# EAGLE design RelayBoard (EAGLE 5.12)

## Sheet 1 of 4
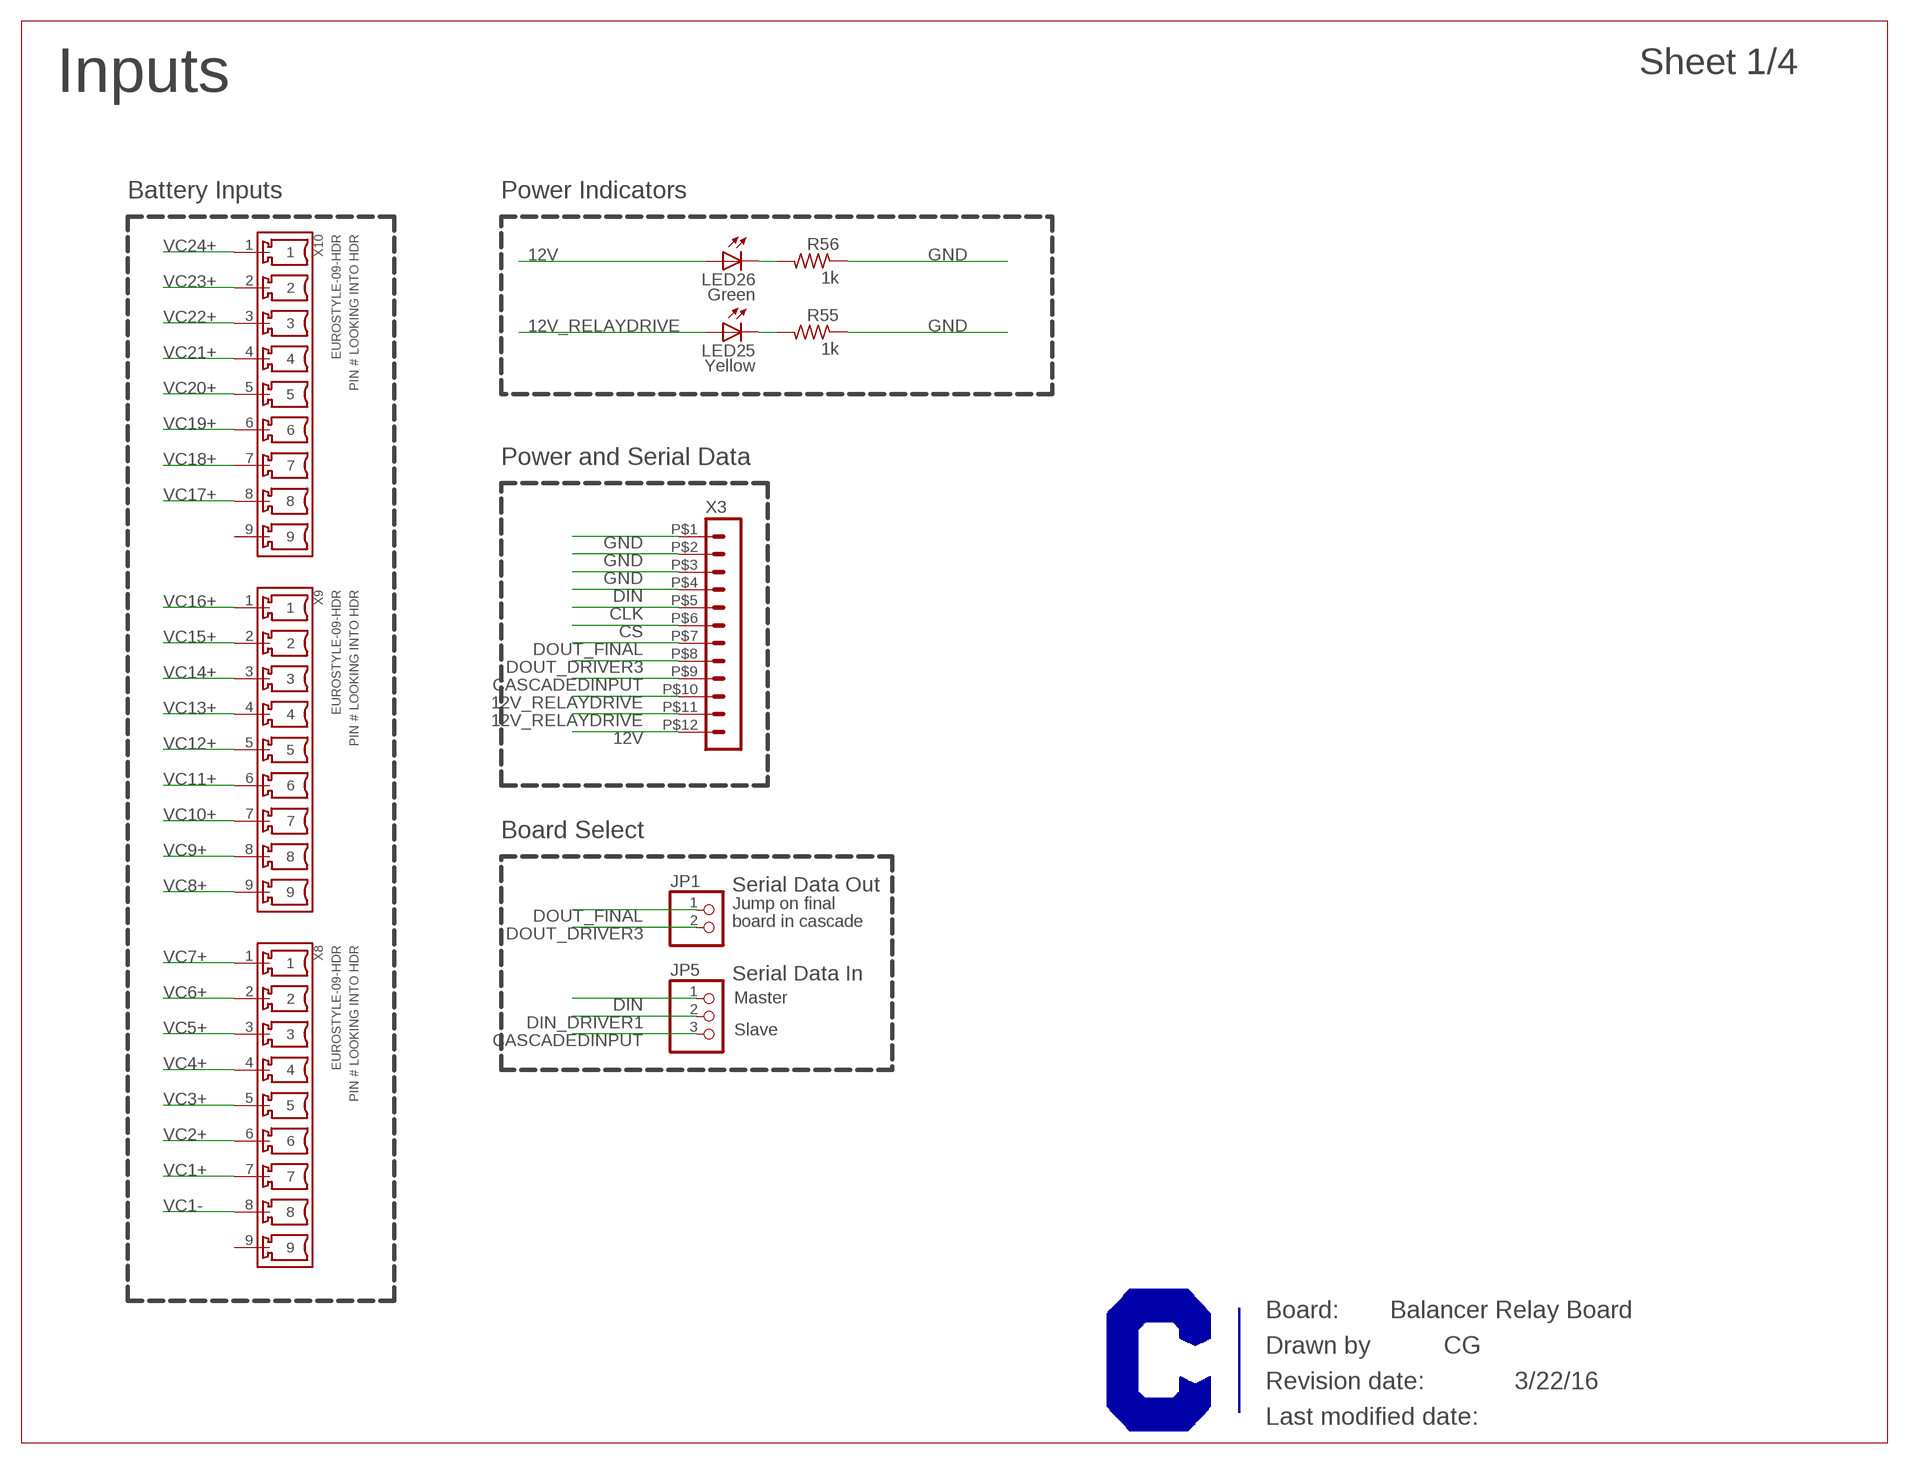
[diagram p0: schematic, sheet 1]

### Parts
JP1  PINHD-1X2  [1X02]
JP5  PINHD-1X3  [1X03]
LED25  Yellow  LEDSML0805  [SML0805]
LED26  Green  LEDSML0805  [SML0805]
R55  1k  R-US_R0603  [R0603]
R56  1k  R-US_R0603  [R0603]
X3  HEADER_POS12_43045-1200  [43045-1200]
X8  EUROSTYLE-09-HDR  [EUROSTYLE_HEADER-9CKT-RA]
X9  EUROSTYLE-09-HDR  [EUROSTYLE_HEADER-9CKT-RA]
X10  EUROSTYLE-09-HDR  [EUROSTYLE_HEADER-9CKT-RA]

### Nets
12V: LED26.A X3.P$12 ; also sheet 2,3,4
12V_RELAYDRIVE [100ma]: LED25.A X3.P$10 X3.P$11 ; also sheet 2,3,4
CASCADEDINPUT: JP5.3 X3.P$9
CLK: X3.P$5 ; also sheet 2,3,4
CS: X3.P$6 ; also sheet 2,3,4
DIN: JP5.1 X3.P$4
DIN_DRIVER1: JP5.2 ; also sheet 2
DOUT_DRIVER3: JP1.2 X3.P$8 ; also sheet 4
DOUT_FINAL: JP1.1 X3.P$7
GND: R55.1 R56.1 X3.P$1 X3.P$2 X3.P$3 ; also sheet 2,3,4
N$49: LED25.C R55.2
N$50: LED26.C R56.2
VC1+ [5A]: X8.7 ; also sheet 4
VC1- [5A]: X8.8 ; also sheet 4
VC2+ [5A]: X8.6 ; also sheet 4
VC3+ [5A]: X8.5 ; also sheet 4
VC4+ [5A]: X8.4 ; also sheet 4
VC5+ [5A]: X8.3 ; also sheet 4
VC6+ [5A]: X8.2 ; also sheet 4
VC7+ [5A]: X8.1 ; also sheet 4
VC8+ [5A]: X9.9 ; also sheet 3,4
VC9+ [5A]: X9.8 ; also sheet 3
VC10+ [5A]: X9.7 ; also sheet 3
VC11+ [5A]: X9.6 ; also sheet 3
VC12+ [5A]: X9.5 ; also sheet 3
VC13+ [5A]: X9.4 ; also sheet 3
VC14+ [5A]: X9.3 ; also sheet 3
VC15+ [5A]: X9.2 ; also sheet 3
VC16+ [5A]: X9.1 ; also sheet 2,3
VC17+ [5A]: X10.8 ; also sheet 2
VC18+ [5A]: X10.7 ; also sheet 2
VC19+ [5A]: X10.6 ; also sheet 2
VC20+ [5A]: X10.5 ; also sheet 2
VC21+ [5A]: X10.4 ; also sheet 2
VC22+ [5A]: X10.3 ; also sheet 2
VC23+ [5A]: X10.2 ; also sheet 2
VC24+ [5A]: X10.1 ; also sheet 2
Unconnected: X8.9 X10.9

### Notes on the sheet
- Inputs
- Battery Inputs | Power Indicators
- Power and Serial Data
- Board Select
- Serial Data Out
- Jump on final
- board in cascade
- Serial Data In
- Master
- Slave
- Balancer Relay Board
- CG
- 3/22/16

## Sheet 2 of 4
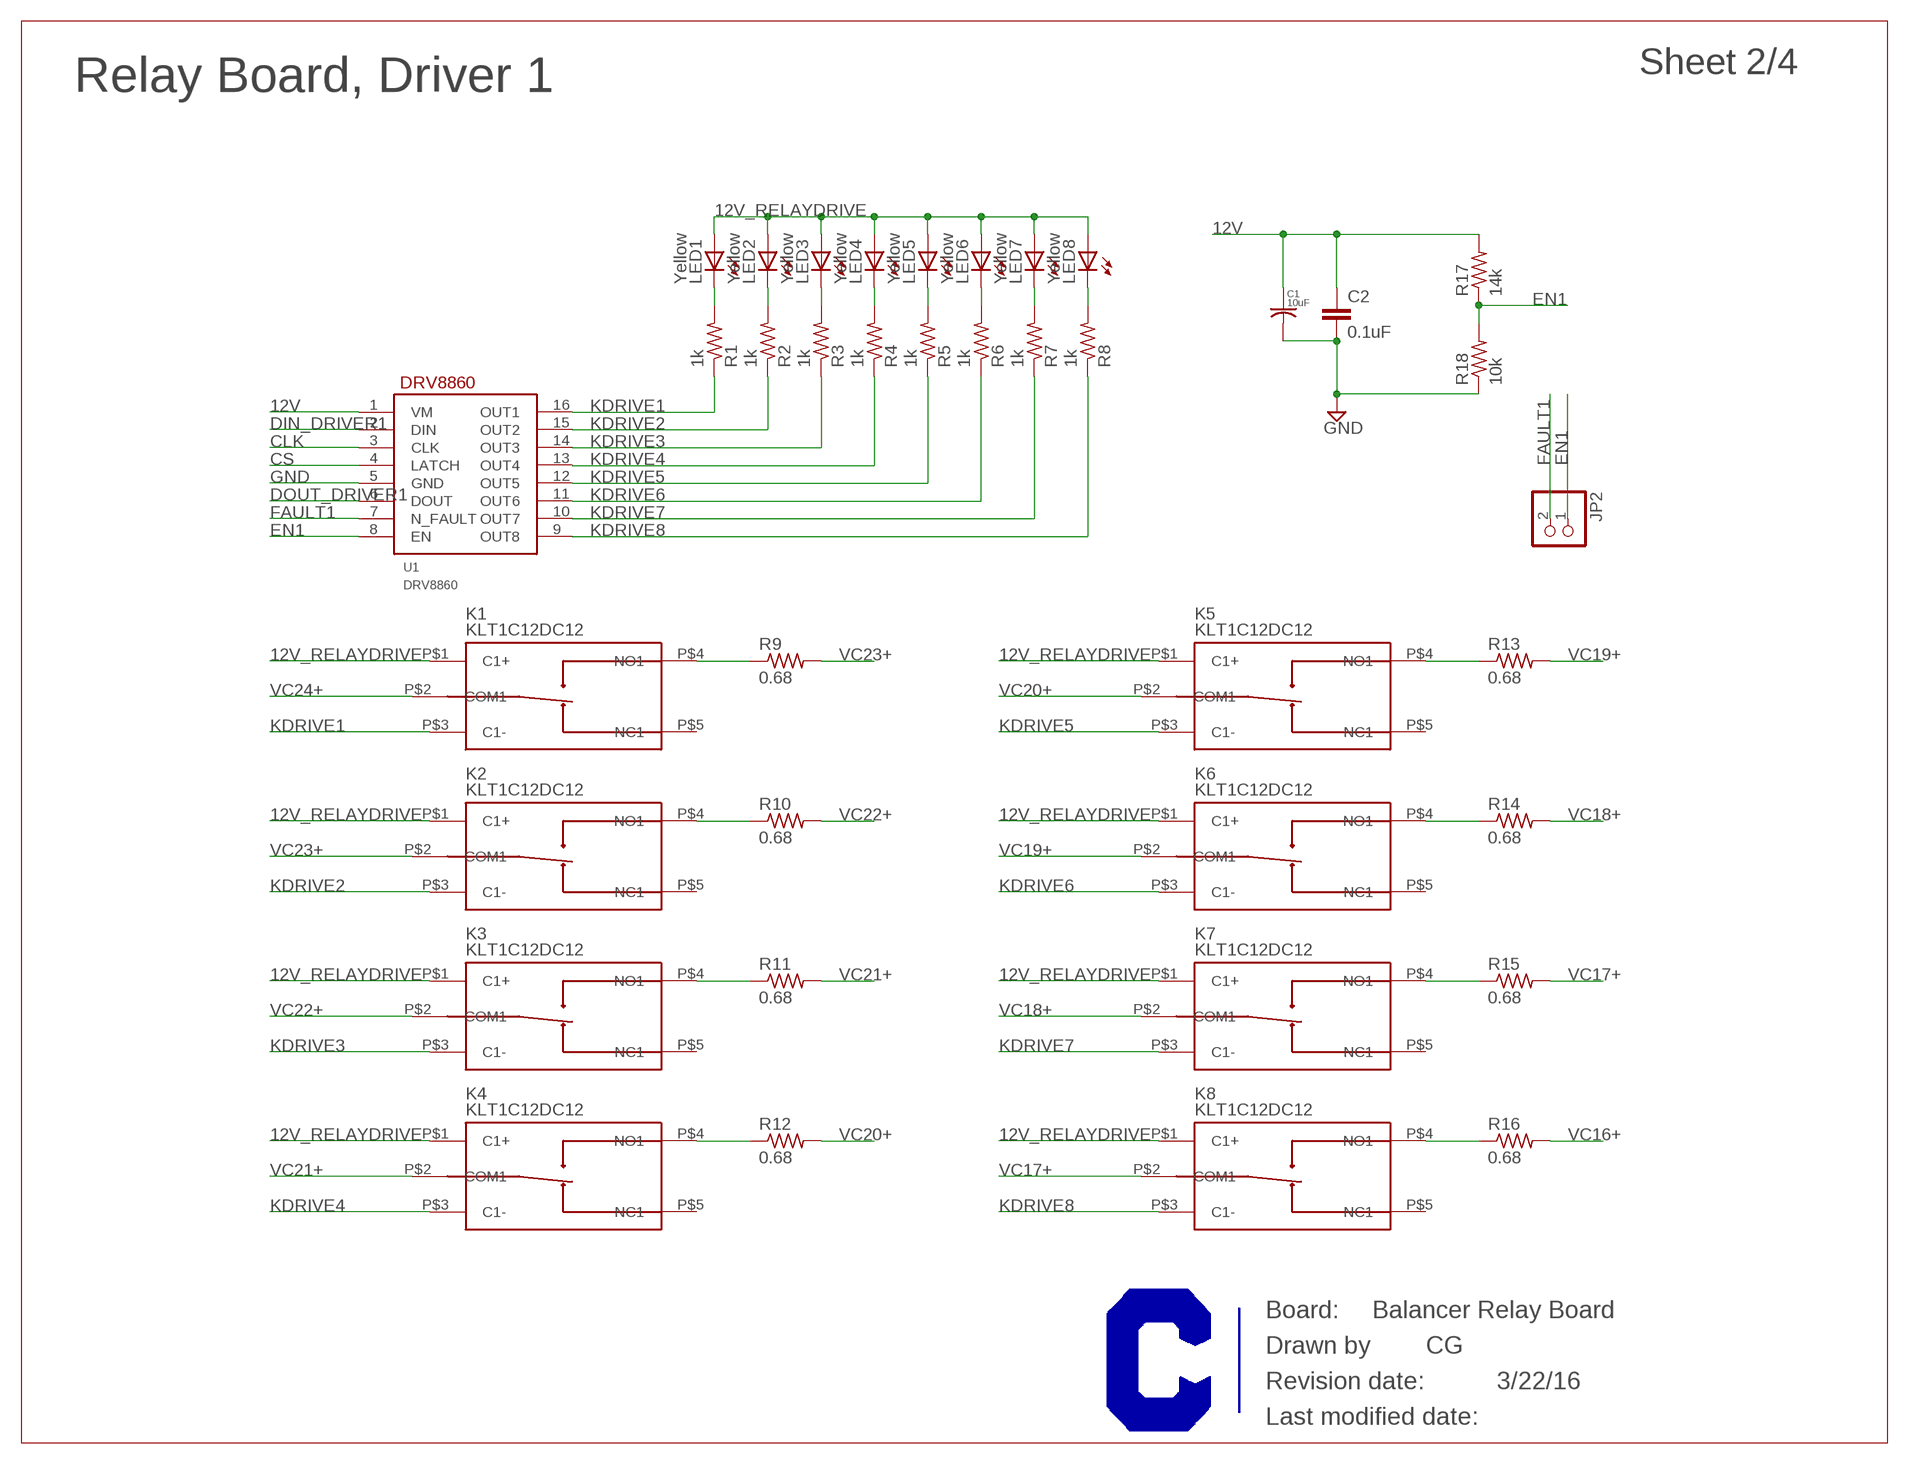
[diagram p1: schematic, sheet 2]

### Parts
C1  10uF  C-USC0805  [C0805]
C2  0.1uF  C-EUC0603  [C0603]
JP2  PINHD-1X2  [1X02]
K1  KLT1C12DC12  [KLT_SERIES]
K2  KLT1C12DC12  [KLT_SERIES]
K3  KLT1C12DC12  [KLT_SERIES]
K4  KLT1C12DC12  [KLT_SERIES]
K5  KLT1C12DC12  [KLT_SERIES]
K6  KLT1C12DC12  [KLT_SERIES]
K7  KLT1C12DC12  [KLT_SERIES]
K8  KLT1C12DC12  [KLT_SERIES]
LED1  Yellow  LEDSML0805  [SML0805]
LED2  Yellow  LEDSML0805  [SML0805]
LED3  Yellow  LEDSML0805  [SML0805]
LED4  Yellow  LEDSML0805  [SML0805]
LED5  Yellow  LEDSML0805  [SML0805]
LED6  Yellow  LEDSML0805  [SML0805]
LED7  Yellow  LEDSML0805  [SML0805]
LED8  Yellow  LEDSML0805  [SML0805]
R1  1k  R-US_R0603  [R0603]
R2  1k  R-US_R0603  [R0603]
R3  1k  R-US_R0603  [R0603]
R4  1k  R-US_R0603  [R0603]
R5  1k  R-US_R0603  [R0603]
R6  1k  R-US_R0603  [R0603]
R7  1k  R-US_R0603  [R0603]
R8  1k  R-US_R0603  [R0603]
R9  0.68  THS50_RESISTOR  [POWER_RESISTOR_FLYING_LEADS]
R10  0.68  THS50_RESISTOR  [POWER_RESISTOR_FLYING_LEADS]
R11  0.68  THS50_RESISTOR  [POWER_RESISTOR_FLYING_LEADS]
R12  0.68  THS50_RESISTOR  [POWER_RESISTOR_FLYING_LEADS]
R13  0.68  THS50_RESISTOR  [POWER_RESISTOR_FLYING_LEADS]
R14  0.68  THS50_RESISTOR  [POWER_RESISTOR_FLYING_LEADS]
R15  0.68  THS50_RESISTOR  [POWER_RESISTOR_FLYING_LEADS]
R16  0.68  THS50_RESISTOR  [POWER_RESISTOR_FLYING_LEADS]
R17  14k  R-US_R0603  [R0603]
R18  10k  R-US_R0603  [R0603]
U1  DRV8860  DRV8860PW  [TSSOP16]

### Nets
12V: C1.1 C2.1 R17.2 U1.1(VM) ; also sheet 1,3,4
12V_RELAYDRIVE [100ma]: K1.P$1(C1+) K2.P$1(C1+) K3.P$1(C1+) K4.P$1(C1+) K5.P$1(C1+) K6.P$1(C1+) K7.P$1(C1+) K8.P$1(C1+) LED1.A LED2.A LED3.A LED4.A LED5.A LED6.A LED7.A LED8.A ; also sheet 1,3,4
CLK: U1.3(CLK) ; also sheet 1,3,4
CS: U1.4(LATCH) ; also sheet 1,3,4
DIN_DRIVER1: U1.2(DIN) ; also sheet 1
DOUT_DRIVER1: U1.6(DOUT) ; also sheet 3
EN1: JP2.1 R17.1 R18.2 U1.8(EN)
FAULT1: JP2.2 U1.7(N_FAULT)
GND: C1.2 C2.2 R18.1 U1.5(GND) ; also sheet 1,3,4
KDRIVE1 [100ma]: K1.P$3(C1-) R1.1 U1.16(OUT1)
KDRIVE2 [100ma]: K2.P$3(C1-) R2.1 U1.15(OUT2)
KDRIVE3 [100ma]: K3.P$3(C1-) R3.1 U1.14(OUT3)
KDRIVE4 [100ma]: K4.P$3(C1-) R4.1 U1.13(OUT4)
KDRIVE5 [100ma]: K5.P$3(C1-) R5.1 U1.12(OUT5)
KDRIVE6 [100ma]: K6.P$3(C1-) R6.1 U1.11(OUT6)
KDRIVE7 [100ma]: K7.P$3(C1-) R7.1 U1.10(OUT7)
KDRIVE8 [100ma]: K8.P$3(C1-) R8.1 U1.9(OUT8)
N$1: LED1.C R1.2
N$2: LED2.C R2.2
N$3: LED3.C R3.2
N$4: LED4.C R4.2
N$5: LED5.C R5.2
N$6: LED6.C R6.2
N$7: LED7.C R7.2
N$8: LED8.C R8.2
N$9: K2.P$4(NO1) R10.P$1
N$10: K3.P$4(NO1) R11.P$1
N$11: K4.P$4(NO1) R12.P$1
N$12: K5.P$4(NO1) R13.P$1
N$13: K6.P$4(NO1) R14.P$1
N$14: K7.P$4(NO1) R15.P$1
N$15: K1.P$4(NO1) R9.P$1
N$16: K8.P$4(NO1) R16.P$1
VC16+ [5A]: R16.P$2 ; also sheet 1,3
VC17+ [5A]: K8.P$2(COM1) R15.P$2 ; also sheet 1
VC18+ [5A]: K7.P$2(COM1) R14.P$2 ; also sheet 1
VC19+ [5A]: K6.P$2(COM1) R13.P$2 ; also sheet 1
VC20+ [5A]: K5.P$2(COM1) R12.P$2 ; also sheet 1
VC21+ [5A]: K4.P$2(COM1) R11.P$2 ; also sheet 1
VC22+ [5A]: K3.P$2(COM1) R10.P$2 ; also sheet 1
VC23+ [5A]: K2.P$2(COM1) R9.P$2 ; also sheet 1
VC24+ [5A]: K1.P$2(COM1) ; also sheet 1
Unconnected: K1.P$5(NC1) K2.P$5(NC1) K3.P$5(NC1) K4.P$5(NC1) K5.P$5(NC1) K6.P$5(NC1) K7.P$5(NC1) K8.P$5(NC1)

### Notes on the sheet
- Relay Board, Driver 1
- Balancer Relay Board
- CG
- 3/22/16

## Sheet 3 of 4
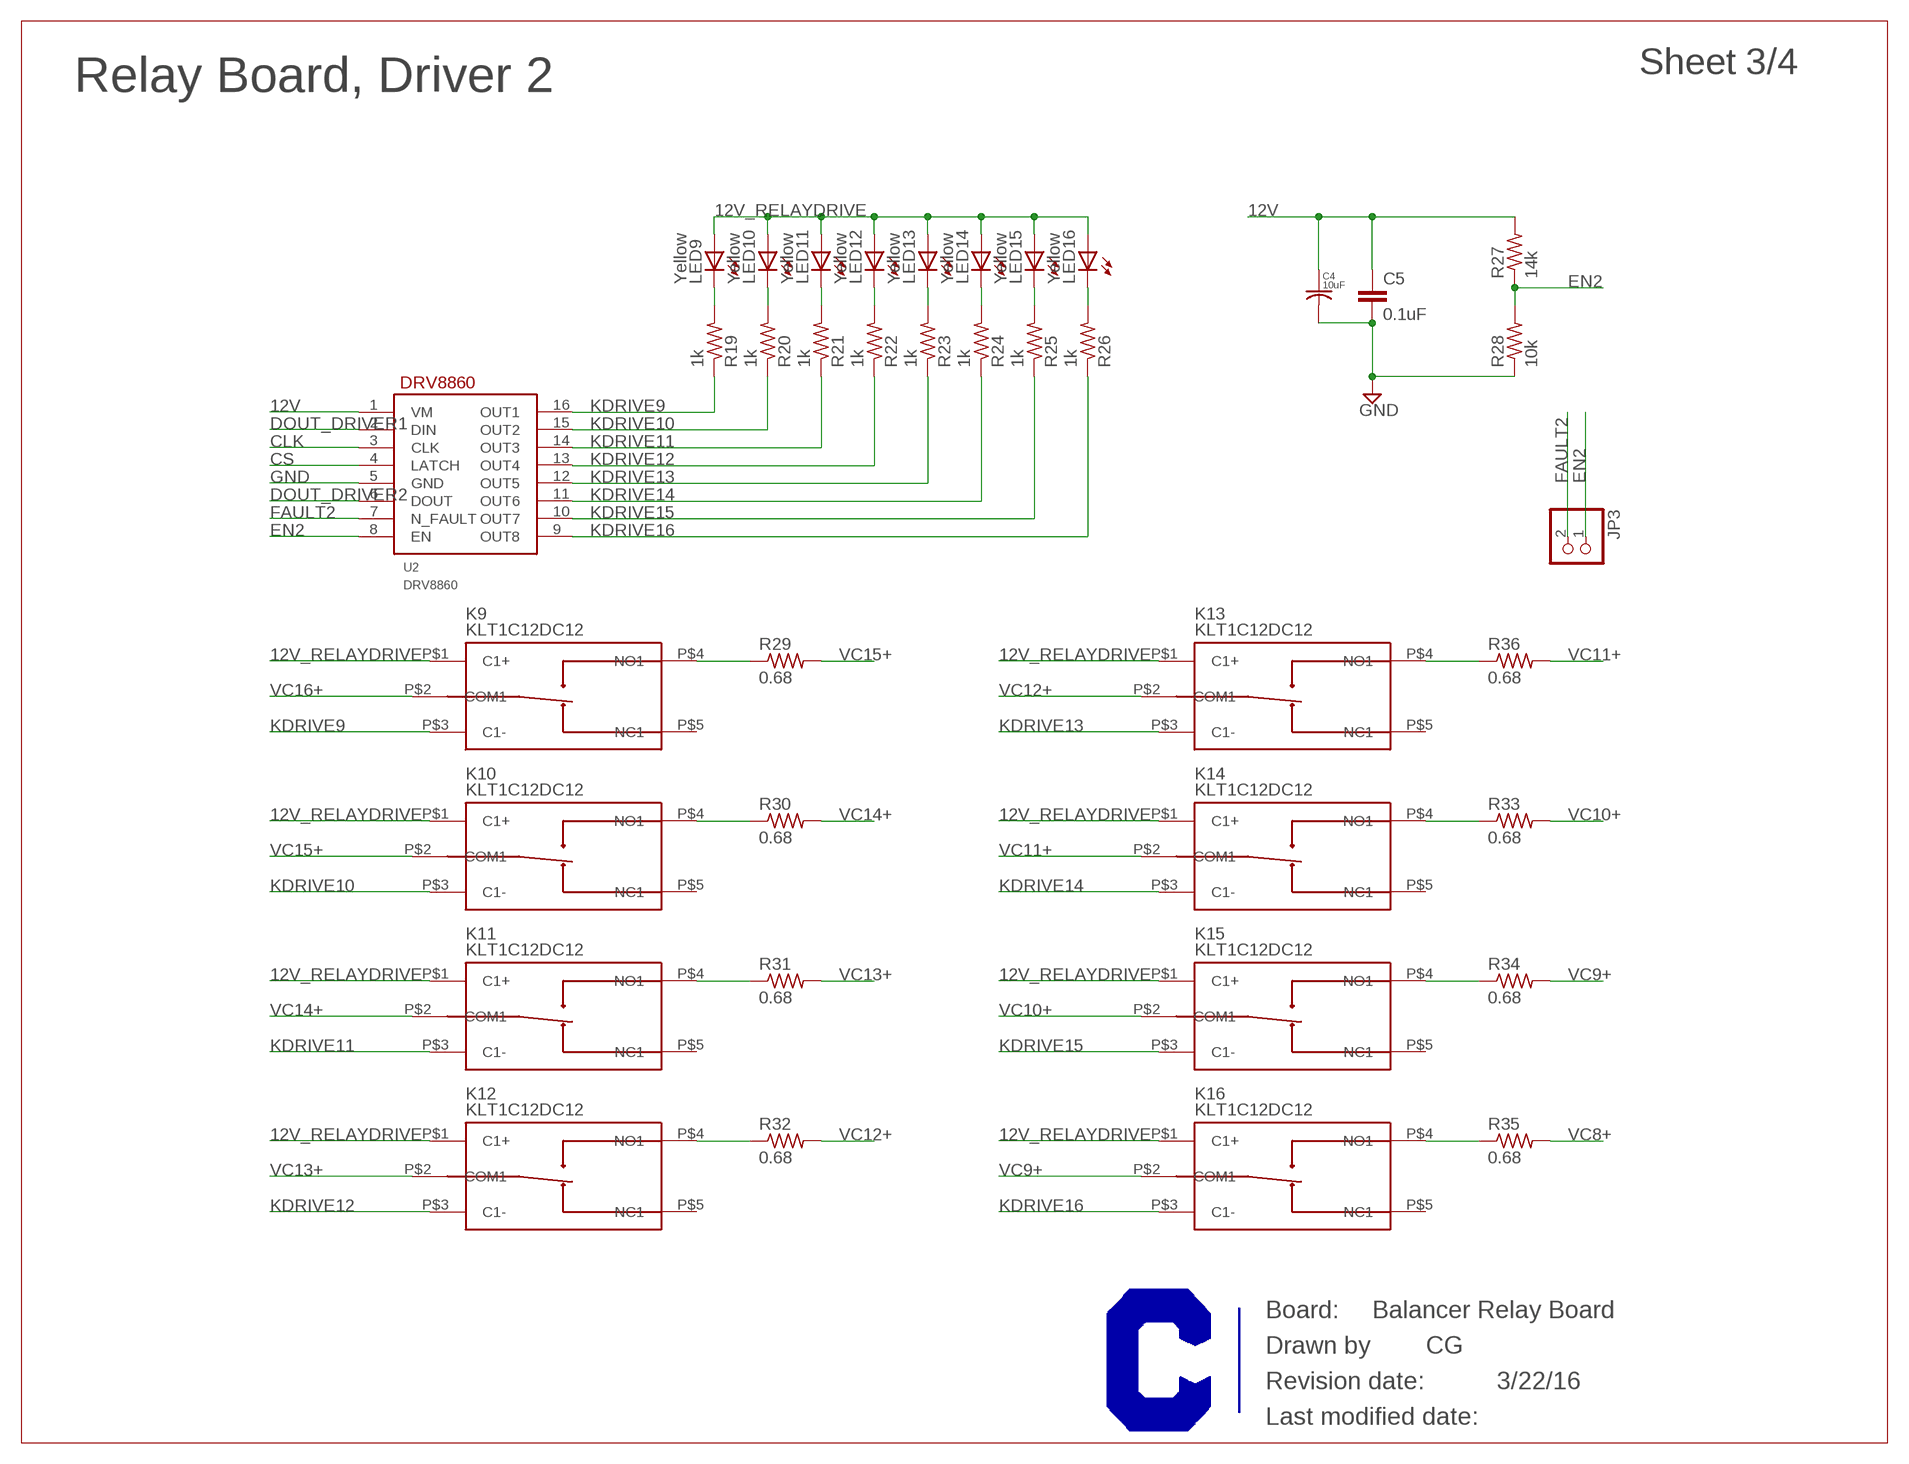
[diagram p2: schematic, sheet 3]

### Parts
C4  10uF  C-USC0805  [C0805]
C5  0.1uF  C-EUC0603  [C0603]
JP3  PINHD-1X2  [1X02]
K9  KLT1C12DC12  [KLT_SERIES]
K10  KLT1C12DC12  [KLT_SERIES]
K11  KLT1C12DC12  [KLT_SERIES]
K12  KLT1C12DC12  [KLT_SERIES]
K13  KLT1C12DC12  [KLT_SERIES]
K14  KLT1C12DC12  [KLT_SERIES]
K15  KLT1C12DC12  [KLT_SERIES]
K16  KLT1C12DC12  [KLT_SERIES]
LED9  Yellow  LEDSML0805  [SML0805]
LED10  Yellow  LEDSML0805  [SML0805]
LED11  Yellow  LEDSML0805  [SML0805]
LED12  Yellow  LEDSML0805  [SML0805]
LED13  Yellow  LEDSML0805  [SML0805]
LED14  Yellow  LEDSML0805  [SML0805]
LED15  Yellow  LEDSML0805  [SML0805]
LED16  Yellow  LEDSML0805  [SML0805]
R19  1k  R-US_R0603  [R0603]
R20  1k  R-US_R0603  [R0603]
R21  1k  R-US_R0603  [R0603]
R22  1k  R-US_R0603  [R0603]
R23  1k  R-US_R0603  [R0603]
R24  1k  R-US_R0603  [R0603]
R25  1k  R-US_R0603  [R0603]
R26  1k  R-US_R0603  [R0603]
R27  14k  R-US_R0603  [R0603]
R28  10k  R-US_R0603  [R0603]
R29  0.68  THS50_RESISTOR  [POWER_RESISTOR_FLYING_LEADS]
R30  0.68  THS50_RESISTOR  [POWER_RESISTOR_FLYING_LEADS]
R31  0.68  THS50_RESISTOR  [POWER_RESISTOR_FLYING_LEADS]
R32  0.68  THS50_RESISTOR  [POWER_RESISTOR_FLYING_LEADS]
R33  0.68  THS50_RESISTOR  [POWER_RESISTOR_FLYING_LEADS]
R34  0.68  THS50_RESISTOR  [POWER_RESISTOR_FLYING_LEADS]
R35  0.68  THS50_RESISTOR  [POWER_RESISTOR_FLYING_LEADS]
R36  0.68  THS50_RESISTOR  [POWER_RESISTOR_FLYING_LEADS]
U2  DRV8860  DRV8860PW  [TSSOP16]

### Nets
12V: C4.1 C5.1 R27.2 U2.1(VM) ; also sheet 1,2,4
12V_RELAYDRIVE [100ma]: K9.P$1(C1+) K10.P$1(C1+) K11.P$1(C1+) K12.P$1(C1+) K13.P$1(C1+) K14.P$1(C1+) K15.P$1(C1+) K16.P$1(C1+) LED9.A LED10.A LED11.A LED12.A LED13.A LED14.A LED15.A LED16.A ; also sheet 1,2,4
CLK: U2.3(CLK) ; also sheet 1,2,4
CS: U2.4(LATCH) ; also sheet 1,2,4
DOUT_DRIVER1: U2.2(DIN) ; also sheet 2
DOUT_DRIVER2: U2.6(DOUT) ; also sheet 4
EN2: JP3.1 R27.1 R28.2 U2.8(EN)
FAULT2: JP3.2 U2.7(N_FAULT)
GND: C4.2 C5.2 R28.1 U2.5(GND) ; also sheet 1,2,4
KDRIVE9 [100ma]: K9.P$3(C1-) R19.1 U2.16(OUT1)
KDRIVE10 [100ma]: K10.P$3(C1-) R20.1 U2.15(OUT2)
KDRIVE11 [100ma]: K11.P$3(C1-) R21.1 U2.14(OUT3)
KDRIVE12 [100ma]: K12.P$3(C1-) R22.1 U2.13(OUT4)
KDRIVE13 [100ma]: K13.P$3(C1-) R23.1 U2.12(OUT5)
KDRIVE14 [100ma]: K14.P$3(C1-) R24.1 U2.11(OUT6)
KDRIVE15 [100ma]: K15.P$3(C1-) R25.1 U2.10(OUT7)
KDRIVE16 [100ma]: K16.P$3(C1-) R26.1 U2.9(OUT8)
N$17: LED9.C R19.2
N$18: LED10.C R20.2
N$19: LED11.C R21.2
N$20: LED12.C R22.2
N$21: LED13.C R23.2
N$22: LED14.C R24.2
N$23: LED15.C R25.2
N$24: LED16.C R26.2
N$25: K9.P$4(NO1) R29.P$1
N$26: K10.P$4(NO1) R30.P$1
N$27: K11.P$4(NO1) R31.P$1
N$28: K12.P$4(NO1) R32.P$1
N$29: K13.P$4(NO1) R36.P$1
N$30: K14.P$4(NO1) R33.P$1
N$31: K15.P$4(NO1) R34.P$1
N$32: K16.P$4(NO1) R35.P$1
VC8+ [5A]: R35.P$2 ; also sheet 1,4
VC9+ [5A]: K16.P$2(COM1) R34.P$2 ; also sheet 1
VC10+ [5A]: K15.P$2(COM1) R33.P$2 ; also sheet 1
VC11+ [5A]: K14.P$2(COM1) R36.P$2 ; also sheet 1
VC12+ [5A]: K13.P$2(COM1) R32.P$2 ; also sheet 1
VC13+ [5A]: K12.P$2(COM1) R31.P$2 ; also sheet 1
VC14+ [5A]: K11.P$2(COM1) R30.P$2 ; also sheet 1
VC15+ [5A]: K10.P$2(COM1) R29.P$2 ; also sheet 1
VC16+ [5A]: K9.P$2(COM1) ; also sheet 1,2
Unconnected: K9.P$5(NC1) K10.P$5(NC1) K11.P$5(NC1) K12.P$5(NC1) K13.P$5(NC1) K14.P$5(NC1) K15.P$5(NC1) K16.P$5(NC1)

### Notes on the sheet
- Relay Board, Driver 2
- Balancer Relay Board
- CG
- 3/22/16

## Sheet 4 of 4
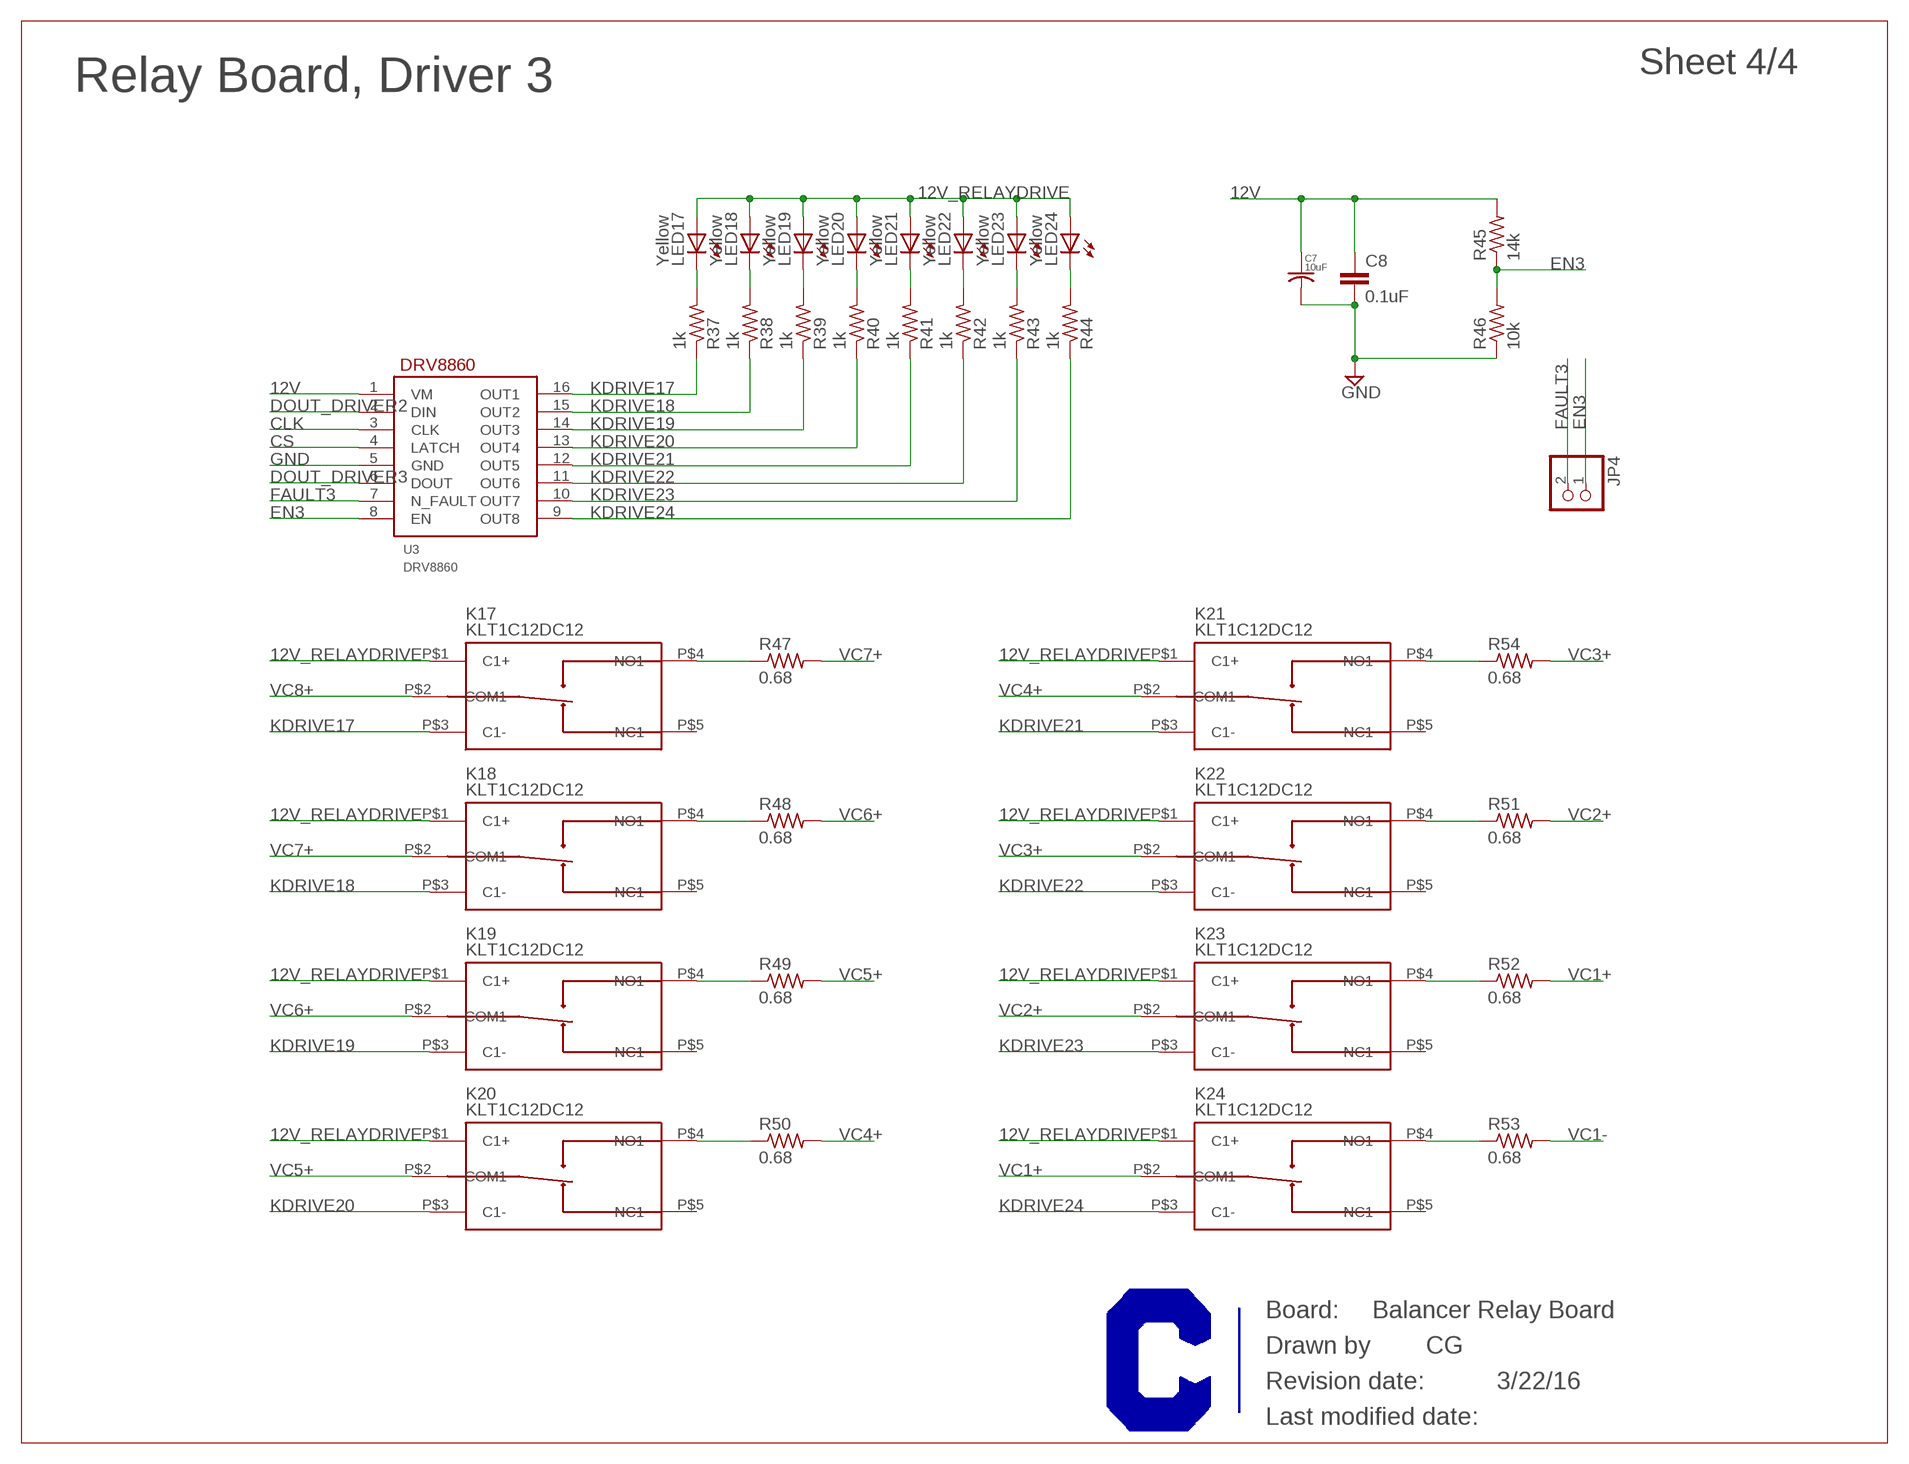
[diagram p3: schematic, sheet 4]

### Parts
C7  10uF  C-USC0805  [C0805]
C8  0.1uF  C-EUC0603  [C0603]
JP4  PINHD-1X2  [1X02]
K17  KLT1C12DC12  [KLT_SERIES]
K18  KLT1C12DC12  [KLT_SERIES]
K19  KLT1C12DC12  [KLT_SERIES]
K20  KLT1C12DC12  [KLT_SERIES]
K21  KLT1C12DC12  [KLT_SERIES]
K22  KLT1C12DC12  [KLT_SERIES]
K23  KLT1C12DC12  [KLT_SERIES]
K24  KLT1C12DC12  [KLT_SERIES]
LED17  Yellow  LEDSML0805  [SML0805]
LED18  Yellow  LEDSML0805  [SML0805]
LED19  Yellow  LEDSML0805  [SML0805]
LED20  Yellow  LEDSML0805  [SML0805]
LED21  Yellow  LEDSML0805  [SML0805]
LED22  Yellow  LEDSML0805  [SML0805]
LED23  Yellow  LEDSML0805  [SML0805]
LED24  Yellow  LEDSML0805  [SML0805]
R37  1k  R-US_R0603  [R0603]
R38  1k  R-US_R0603  [R0603]
R39  1k  R-US_R0603  [R0603]
R40  1k  R-US_R0603  [R0603]
R41  1k  R-US_R0603  [R0603]
R42  1k  R-US_R0603  [R0603]
R43  1k  R-US_R0603  [R0603]
R44  1k  R-US_R0603  [R0603]
R45  14k  R-US_R0603  [R0603]
R46  10k  R-US_R0603  [R0603]
R47  0.68  THS50_RESISTOR  [POWER_RESISTOR_FLYING_LEADS]
R48  0.68  THS50_RESISTOR  [POWER_RESISTOR_FLYING_LEADS]
R49  0.68  THS50_RESISTOR  [POWER_RESISTOR_FLYING_LEADS]
R50  0.68  THS50_RESISTOR  [POWER_RESISTOR_FLYING_LEADS]
R51  0.68  THS50_RESISTOR  [POWER_RESISTOR_FLYING_LEADS]
R52  0.68  THS50_RESISTOR  [POWER_RESISTOR_FLYING_LEADS]
R53  0.68  THS50_RESISTOR  [POWER_RESISTOR_FLYING_LEADS]
R54  0.68  THS50_RESISTOR  [POWER_RESISTOR_FLYING_LEADS]
U3  DRV8860  DRV8860PW  [TSSOP16]

### Nets
12V: C7.1 C8.1 R45.2 U3.1(VM) ; also sheet 1,2,3
12V_RELAYDRIVE [100ma]: K17.P$1(C1+) K18.P$1(C1+) K19.P$1(C1+) K20.P$1(C1+) K21.P$1(C1+) K22.P$1(C1+) K23.P$1(C1+) K24.P$1(C1+) LED17.A LED18.A LED19.A LED20.A LED21.A LED22.A LED23.A LED24.A ; also sheet 1,2,3
CLK: U3.3(CLK) ; also sheet 1,2,3
CS: U3.4(LATCH) ; also sheet 1,2,3
DOUT_DRIVER2: U3.2(DIN) ; also sheet 3
DOUT_DRIVER3: U3.6(DOUT) ; also sheet 1
EN3: JP4.1 R45.1 R46.2 U3.8(EN)
FAULT3: JP4.2 U3.7(N_FAULT)
GND: C7.2 C8.2 R46.1 U3.5(GND) ; also sheet 1,2,3
KDRIVE17 [100ma]: K17.P$3(C1-) R37.1 U3.16(OUT1)
KDRIVE18 [100ma]: K18.P$3(C1-) R38.1 U3.15(OUT2)
KDRIVE19 [100ma]: K19.P$3(C1-) R39.1 U3.14(OUT3)
KDRIVE20 [100ma]: K20.P$3(C1-) R40.1 U3.13(OUT4)
KDRIVE21 [100ma]: K21.P$3(C1-) R41.1 U3.12(OUT5)
KDRIVE22 [100ma]: K22.P$3(C1-) R42.1 U3.11(OUT6)
KDRIVE23 [100ma]: K23.P$3(C1-) R43.1 U3.10(OUT7)
KDRIVE24 [100ma]: K24.P$3(C1-) R44.1 U3.9(OUT8)
N$33: LED17.C R37.2
N$34: LED18.C R38.2
N$35: LED19.C R39.2
N$36: LED20.C R40.2
N$37: LED21.C R41.2
N$38: LED22.C R42.2
N$39: LED23.C R43.2
N$40: LED24.C R44.2
N$41 [5A]: K17.P$4(NO1) R47.P$1
N$42 [5A]: K18.P$4(NO1) R48.P$1
N$43 [5A]: K19.P$4(NO1) R49.P$1
N$44 [5A]: K20.P$4(NO1) R50.P$1
N$45 [5A]: K21.P$4(NO1) R54.P$1
N$46 [5A]: K22.P$4(NO1) R51.P$1
N$47 [5A]: K23.P$4(NO1) R52.P$1
N$48 [5A]: K24.P$4(NO1) R53.P$1
VC1+ [5A]: K24.P$2(COM1) R52.P$2 ; also sheet 1
VC1- [5A]: R53.P$2 ; also sheet 1
VC2+ [5A]: K23.P$2(COM1) R51.P$2 ; also sheet 1
VC3+ [5A]: K22.P$2(COM1) R54.P$2 ; also sheet 1
VC4+ [5A]: K21.P$2(COM1) R50.P$2 ; also sheet 1
VC5+ [5A]: K20.P$2(COM1) R49.P$2 ; also sheet 1
VC6+ [5A]: K19.P$2(COM1) R48.P$2 ; also sheet 1
VC7+ [5A]: K18.P$2(COM1) R47.P$2 ; also sheet 1
VC8+ [5A]: K17.P$2(COM1) ; also sheet 1,3
Unconnected: K17.P$5(NC1) K18.P$5(NC1) K19.P$5(NC1) K20.P$5(NC1) K21.P$5(NC1) K22.P$5(NC1) K23.P$5(NC1) K24.P$5(NC1)

### Notes on the sheet
- Relay Board, Driver 3
- Balancer Relay Board
- CG
- 3/22/16

## Library data of the parts
C1 C4 C7 = rcl:C-US: CAPACITOR, American symbol
C2 C5 C8 = rcl:C-EU: CAPACITOR, European symbol
JP1-JP4 = pinhead:PINHD-1X2: PIN HEADER
JP5 = pinhead:PINHD-1X3: PIN HEADER
K1-K24 = Hasco:KLT1C12DC12: Hasco KLT series relay, KLT1C12DC12 Miniature pc mount power relay. 12 Vdc, 400 Ohm coil. SPDT 12A contacts. 19 x 15.5 x 15.5mm. All Electroncs: KLT1C12DC12 <http://www.allelectronics.com/make-a-store/item/rly-717/12-vdc-12-amp-spdt-relay/1.html> Datasheet:HascoRelays.com <http://www.hascorelays.com/uploads/pdf/KLT.pdf>; PARTNO: KLT1C12DC12
LED1-LED26 = led:LED: LED OSRAM: - CHIPLED LG R971, LG N971, LY N971, LG Q971, LY Q971, LO R971, LY R971 LH N974, LH R974 LS Q976, LO Q976, LY Q976 LO Q996 - Hyper CHIPLED LW Q18S LB Q993, LB Q99A, LB R99A - SideLED LS A670, LO A670, LY A670, LG A670, LP A670 LB A673, LV A673, LT A673, LW A673 LH A674 LY A675 LS A676, LA A676, LO A676, LY A676, LW A676 LS A679, LY A679, LG A679 - Hyper Micro SIDELED® LS Y876, LA Y876, LO Y876, LY Y876 LT Y87S - SmartLED LW L88C, LW L88S LB L89C, LB L89S, LG L890 LS L89K, LO L89K, LY L89K LS L896, LA L896, LO L896, LY L896 - TOPLED LS T670, LO T670, LY T670, LG T670, LP T670 LSG T670, LSP T670, LSY T670, LOP T670, LYG T670 LG T671, LOG T671, LSG T671 LB T673, LV T673, LT T673, LW T673 LH T674 LS T676, LA T676, LO T676, LY T676, LB T676, LH T676, LSB T676, LW T676 LB T67C, LV T67C, LT T67C, LS T67K, LO T67K, LY T67K, LW E67C LS E67B, LA E67B, LO E67B, LY E67B, LB E67C, LV E67C, LT E67C LW T67C LS T679, LY T679, LG T679 LS T770, LO T770, LY T770, LG T770, LP T770 LB T773, LV T773, LT T773, LW T773 LH T774 LS E675, LA E675, LY E675, LS T675 LS T776, LA T776, LO T776, LY T776, LB T776 LHGB T686 LT T68C, LB T68C - Hyper Mini TOPLED® LB M676 - Mini TOPLED Santana® LG M470 LS M47K, LO M47K, LY M47K Source: http://www.osram.convergy.de LUXEON: - LUMILED® LXK2-PW12-R00, LXK2-PW12-S00, LXK2-PW14-U00, LXK2-PW14-V00 LXK2-PM12-R00, LXK2-PM12-S00, LXK2-PM14-U00 LXK2-PE12-Q00, LXK2-PE12-R00, LXK2-PE12-S00, LXK2-PE14-T00, LXK2-PE14-U00 LXK2-PB12-K00, LXK2-PB12-L00, LXK2-PB12-M00, LXK2-PB14-N00, LXK2-PB14-P00, LXK2-PB14-Q00 LXK2-PR12-L00, LXK2-PR12-M00, LXK2-PR14-Q00, LXK2-PR14-R00 LXK2-PD12-Q00, LXK2-PD12-R00, LXK2-PD12-S00 LXK2-PH12-R00, LXK2-PH12-S00 LXK2-PL12-P00, LXK2-PL12-Q00, LXK2-PL12-R00 Source: www.luxeon.com KINGBRIGHT: KA-3528ASYC Source: www.kingbright.com
R1-R8 R17-R28 R37-R46 R55 R56 = rcl:R-US_: RESISTOR, American symbol
R9-R16 R29-R36 R47-R54 = TE:THS50_RESISTOR: TE THS50 Wirewound Power Resistors Datasheet: www.TE.com <https://www.google.com/url?sa=t&rct=j&q=&esrc=s&source=web&cd=1&ved=0ahUKEwjQlbyzr5_LAhWFg4MKHfp9CR4QFggdMAA&url=http%3A%2F%2Fwww.te.com%2Fprodimages%2Fpdf%2FTHS-1006.pdf&usg=AFQjCNEe2IfUdx3KZSabM2vPfTeEVpIUTw&sig2=zgRxT0Puznq7AOs7ihYmqQ&cad=rja>; PARTNO: THS50R68J
U1-U3 = TI:DRV8860: TI DRV8860 Package: TSSOP-16 The DR8860 provides an 8-channel low side driver. It can be used to drive unipolar stepper motors, DC motors, relays, solenoids, or other loads. Newark: DRV8860 <http://www.newark.com/texas-instruments/drv8860pw/motor-driver-stepper-560ma-tssop/dp/11X3139?ost=drv8860&selectedCategoryId=&categoryId=800000004663> Datasheet:http://www.ti.com/lit/gpn/drv8860; PARTNO: DRV8860
X3 = con-molex-micro-fit-3_0:HEADER_POS12_?: Molex - Micro-Fit 3.0 Series connector, 3.00mm (0.118") pitch header, 12 positions.
X8-X10 = Molex:EUROSTYLE-09-HDR: Eurostyle (tm) 3.50mm Pitch PCB Header, 9 Circuits This is the pluggable screw terminal block that Molex makes (like on the BQ76PL536 EVM boards). Molex series number: 39502 (horizontal header), 39501 (vertical header) Mates with: 39500 horizontal plug, 39503 vertical plug Website (horizontal header): http://www.molex.com/molex/products/datasheet.jsp?part=active/0395021009_TERMINAL_BLOCKS.xml Website (vertical header): http://www.molex.com/molex/products/datasheet.jsp?part=active/0395011009_TERMINAL_BLOCKS.xml Datasheet: http://www.mouser.com/ds/2/276/0395021009_TERMINAL_BLOCKS-163866.pdf; PARTNO: 39502-1009

## Net classes
1 100ma: width 0.013 mm
2 5A: width 2.159 mm

## Board
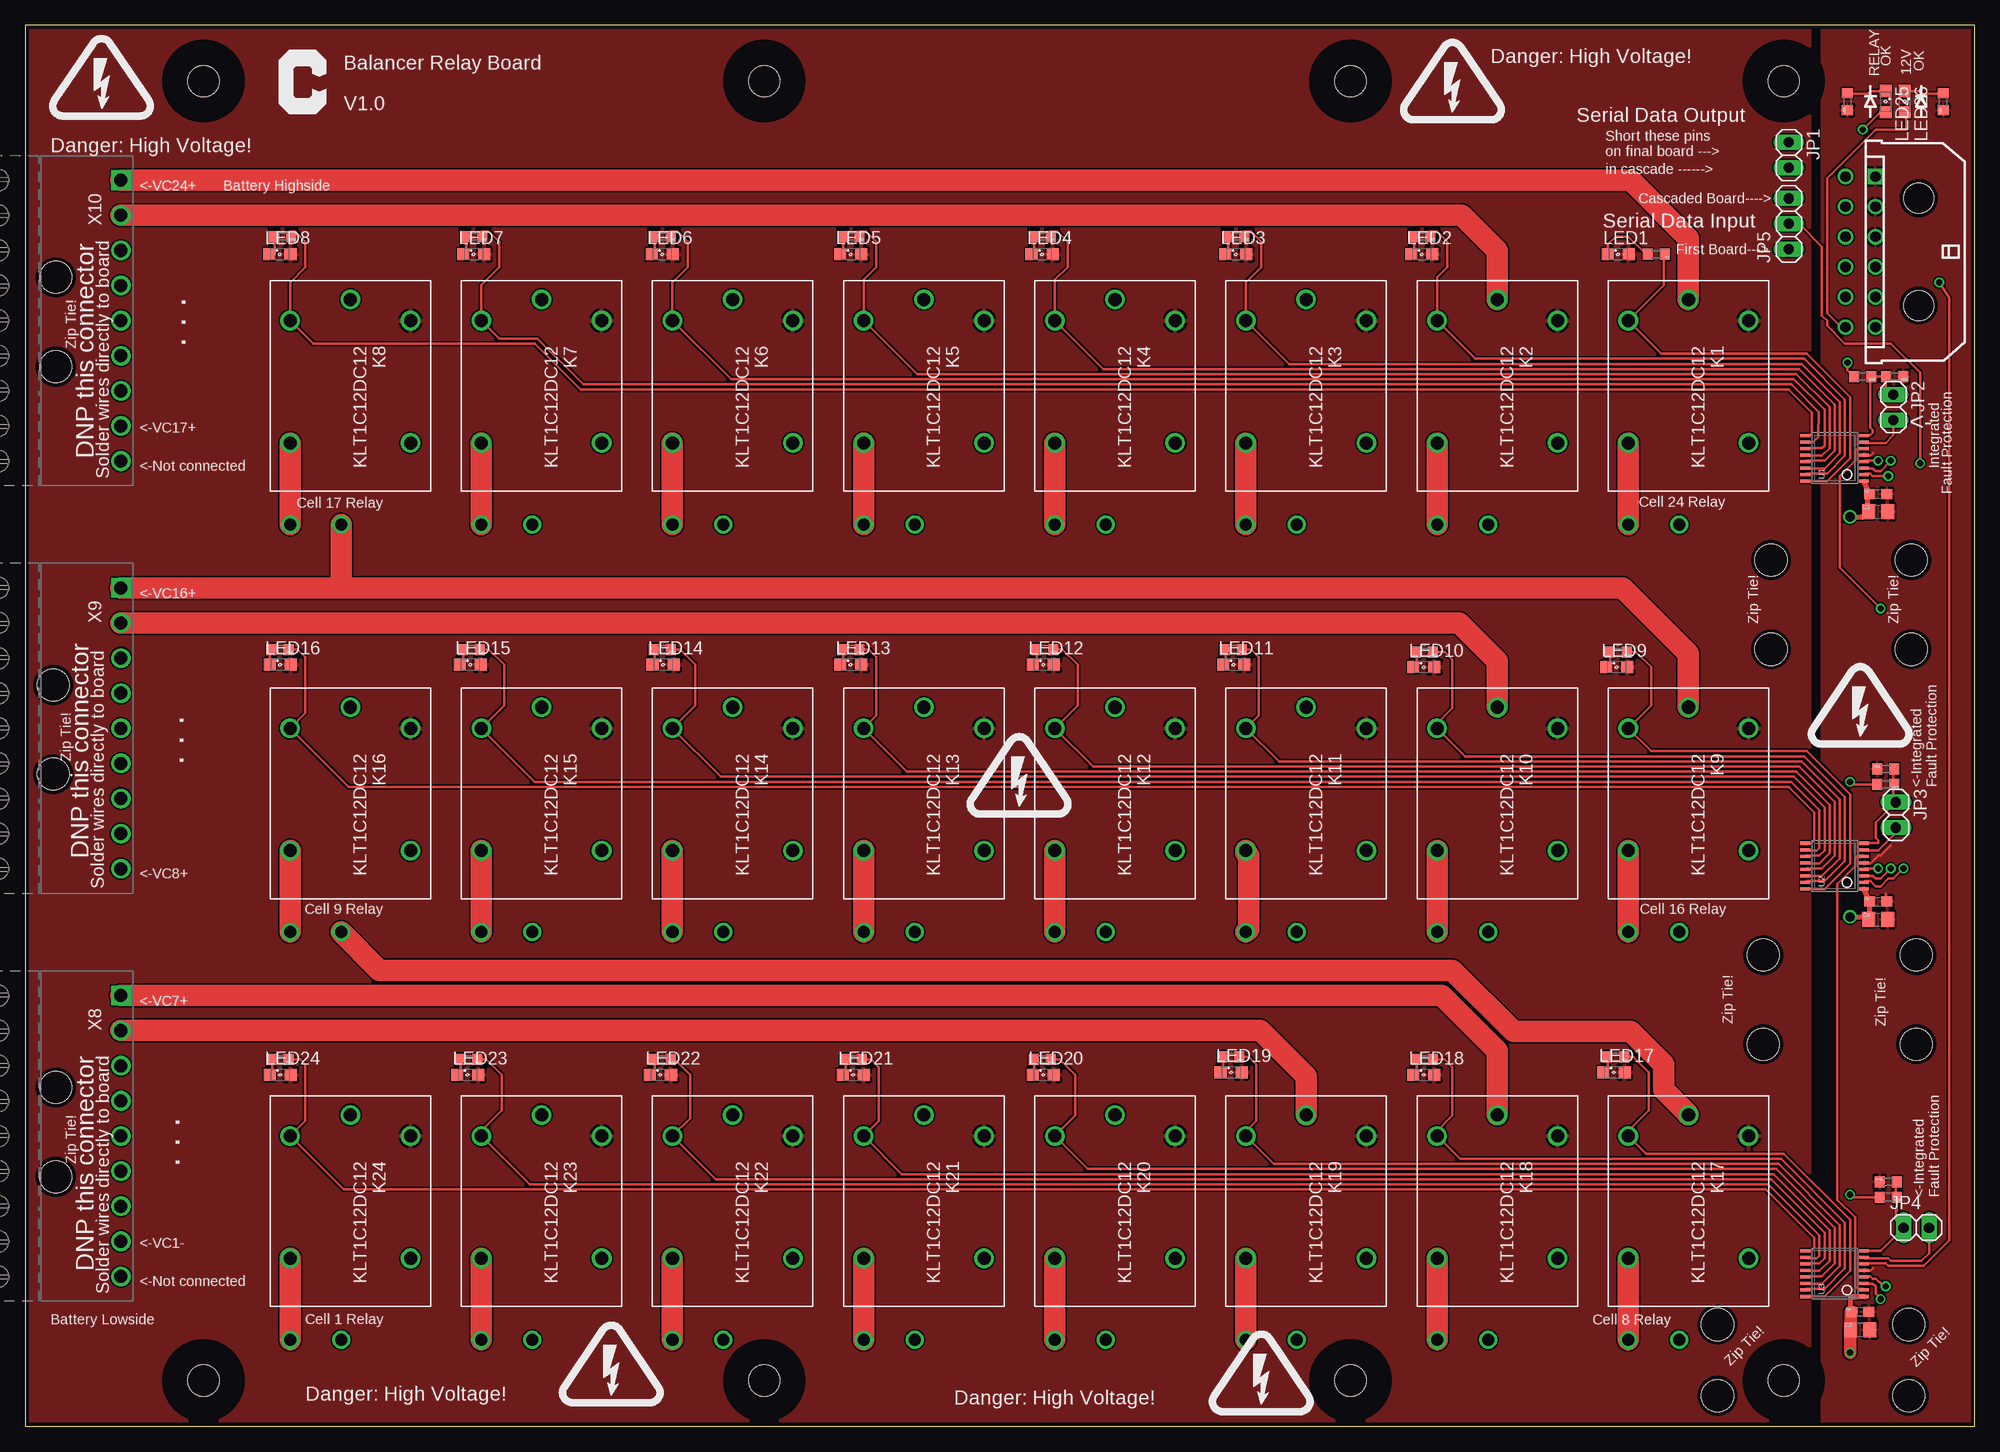
[diagram p4: board, top side]
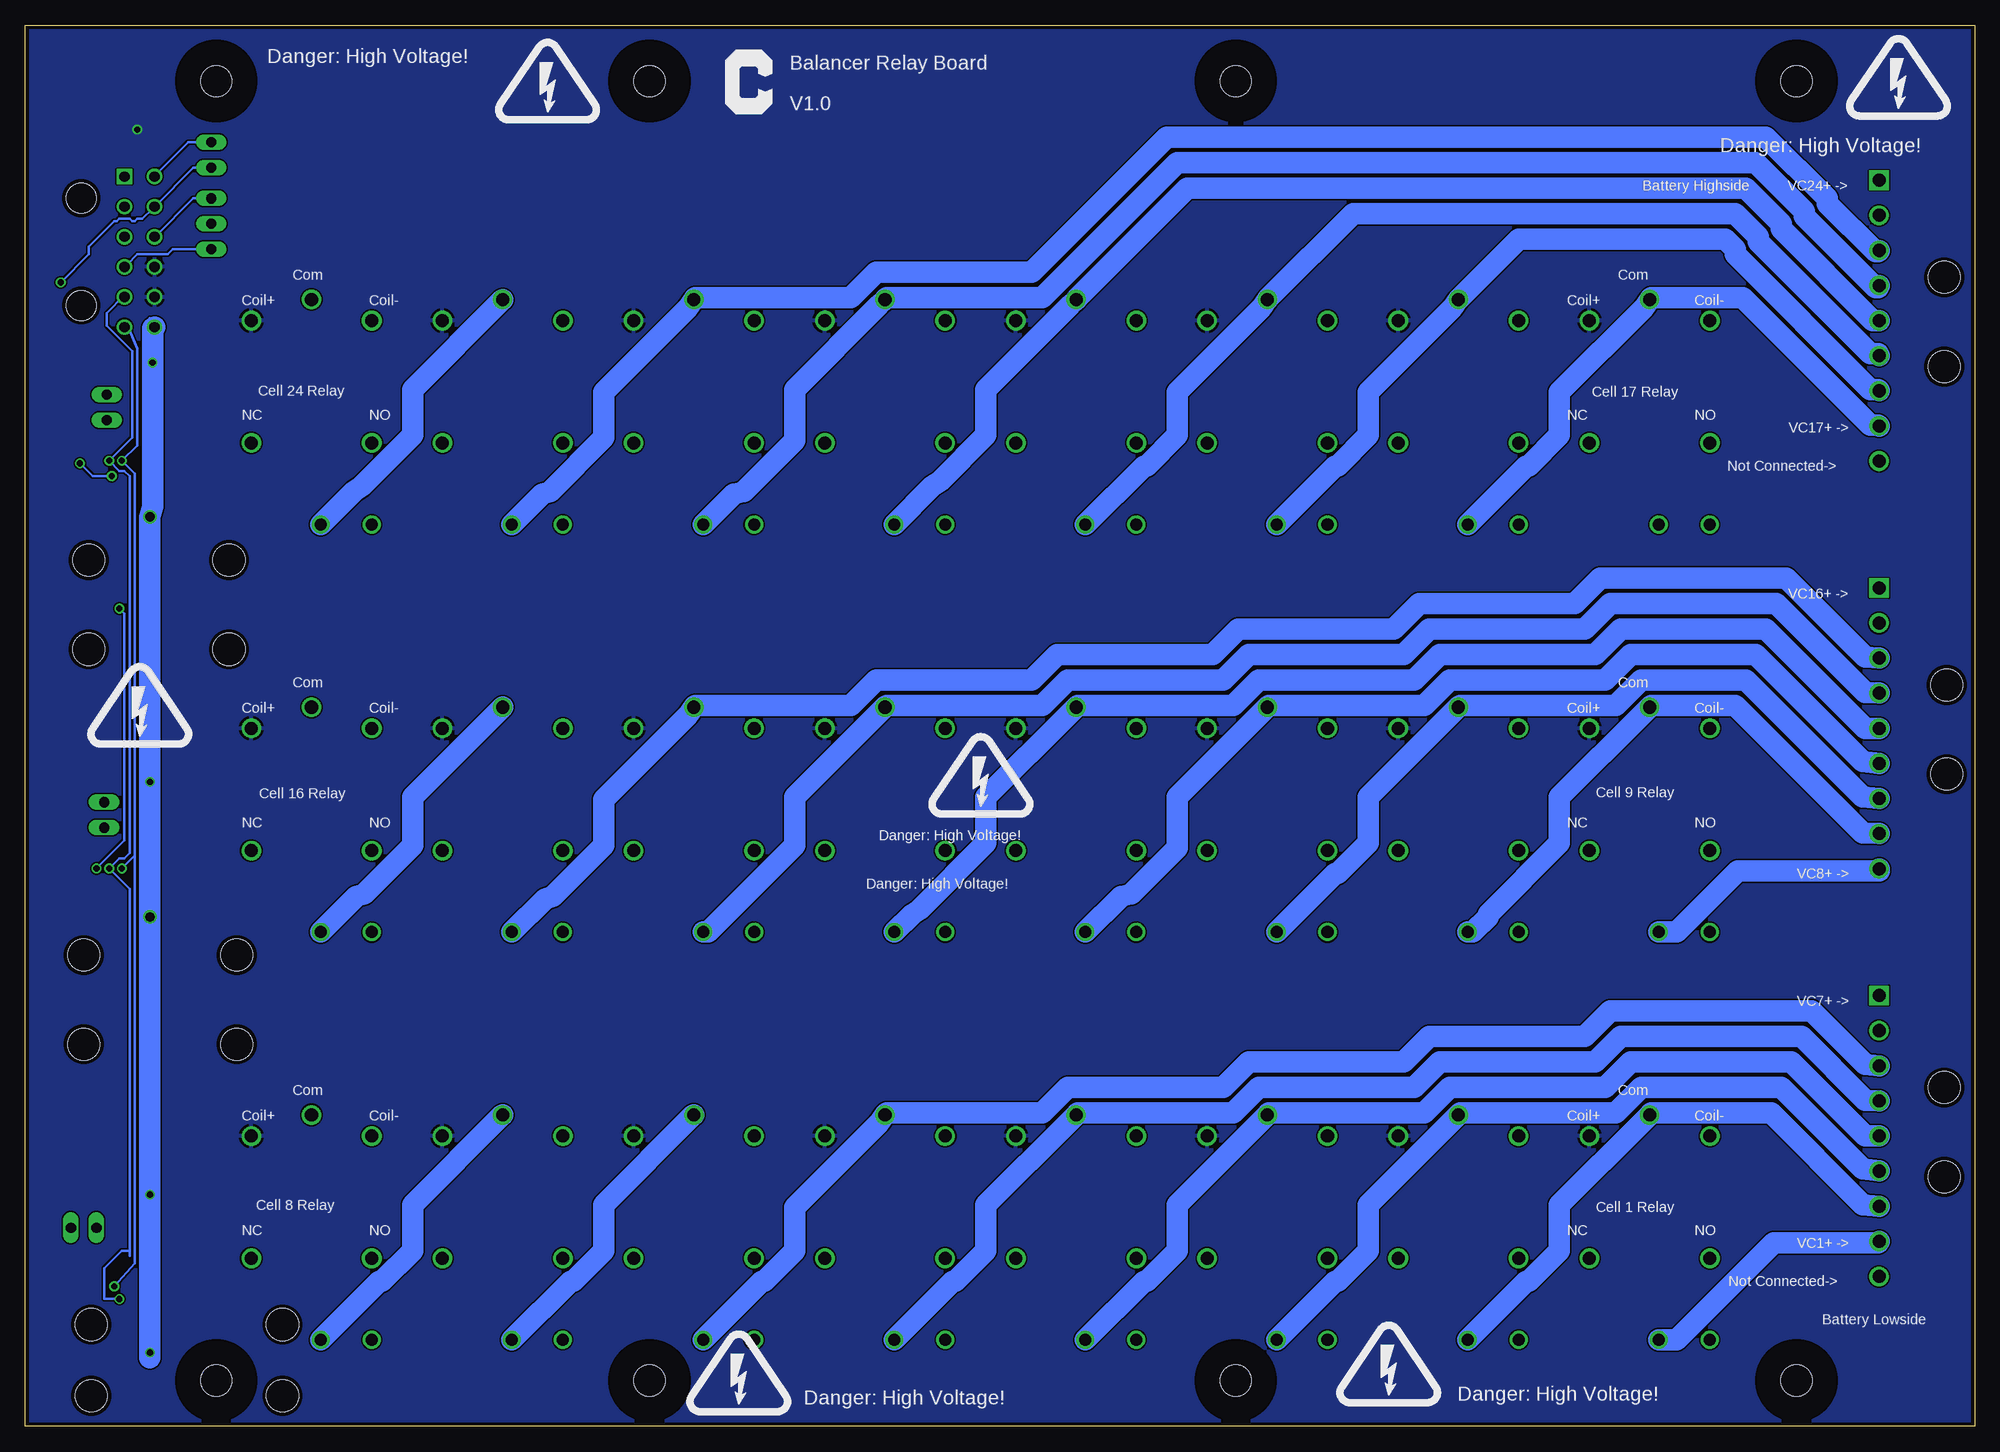
[diagram p5: board, bottom side, seen from below]

Size 194.31 x 139.7 mm. Coordinates in mm from the lower left corner, seen from the top.
Outline: 0,0 194.31,0 194.31,139.7 0,139.7 0,0
Copper layers (1*16): Top 0.0356mm / dielectric 1.5011mm / Bottom 0.0356mm
Design rules "OSH Park 2-layer": minimum track width 6mil, minimum drill 13mil, track to track 6mil, track to pad 6mil, pad to pad 6mil, via to via 6mil, smd to smd 6mil, copper to edge 15mil, drill to drill 6mil, minimum pad ring 7mil, minimum via ring 7mil, stop-mask expansion 4mil, vias tented up to drill 25mil, thermal gap 10mil
Holes 3.1 mm at 17.78,4.58 175.26,4.58 175.26,134.12 17.78,134.12 73.66,134.12 132.08,134.12 73.66,4.58 132.08,4.58
Holes 3.2 mm at 187.71,3.05 187.71,10.16 188.47,38.1 188.47,46.99 187.96,77.47 187.96,86.36 173.23,38.1 173.23,46.99 173.99,77.47 173.99,86.36 168.66,10.16 168.66,3.05 3.05,24.89 3.05,33.78 2.79,65.02 2.79,73.91 3.05,105.66 3.05,114.55
tRestrict: area 13.9,0.7 to 21.7,8.5; area 171.4,0.7 to 179.2,8.5; area 171.4,130.2 to 179.2,138; area 13.9,130.2 to 21.7,138; area 69.8,130.2 to 77.6,138; area 128.2,130.2 to 136,138; area 69.8,0.7 to 77.6,8.5; area 128.2,0.7 to 136,8.5
bRestrict: area 13.9,0.7 to 21.7,8.5; area 171.4,0.7 to 179.2,8.5; area 171.4,130.2 to 179.2,138; area 13.9,130.2 to 21.7,138; area 69.8,130.2 to 77.6,138; area 128.2,130.2 to 136,138; area 69.8,0.7 to 77.6,8.5; area 128.2,0.7 to 136,8.5

### Footprints (pad centres in the part's own frame; a part is rotated, then mirrored left to right if it is on the bottom)
C0805 = smd 1.3 x 1.5: 1 -0.95,0; 2 0.95,0
C0603 = smd 1.1 x 1: 1 -0.85,0; 2 0.85,0
1X02 = drill 1.016 long: 1 -1.27,0; 2 1.27,0
1X03 = drill 1.016 long: 1 -2.54,0; 2 0,0; 3 2.54,0
KLT_SERIES@1 = drill 1.3 round: P$1 0,12; P$2 -2.1,6; P$3 0,0; P$4 12.2,0; P$5 12.2,12
SML0805 = smd 1.2 x 1.2: A 1.05,0; C -1.05,0
R0603 = smd 1 x 1.1: 1 -0.85,0; 2 0.85,0
POWER_RESISTOR_FLYING_LEADS = drill 1.2 round: P$1 0,0; P$2 5.08,0
TSSOP16 = smd 0.305 x 0.991: 1 -2.29,-2.918; 2 -1.64,-2.918; 3 -0.99,-2.918; 4 -0.34,-2.918; 5 0.31,-2.918; 6 0.96,-2.918; 7 1.61,-2.918; 8 2.26,-2.918; 9 2.26,2.918; 10 1.61,2.918; 11 0.96,2.918; 12 0.31,2.918; 13 -0.34,2.918; 14 -0.99,2.918; 15 -1.64,2.918; 16 -2.29,2.918
43045-1200 = drill 1.02 square: P$1 7.5,4.32 | drill 1.02 round: P$2 4.5,4.32; P$3 1.5,4.32; P$4 -1.5,4.32; P$5 -4.5,4.32; P$6 -7.5,4.32; P$7 7.5,7.32; P$8 4.5,7.32; P$9 1.5,7.32; P$10 -1.5,7.32; P$11 -4.5,7.32; P$12 -7.5,7.32 | hole 3: 5.35,0; -5.35,0
EUROSTYLE_HEADER-9CKT-RA = drill 1.3 square: 1 -14,7 | drill 1.3 round: 2 -10.5,7; 3 -7,7; 4 -3.5,7; 5 0,7; 6 3.5,7; 7 7,7; 8 10.5,7; 9 14,7

### Placement (x,y rotation side)
C1  184.66,91.19 0 top
C2  184.66,92.96 0 top
C4  184.66,50.55 0 top
C5  184.66,52.32 0 top
C7  182.88,9.65 0 top
C8  182.88,11.43 0 top
JP1  175.77,126.75 270 top
JP2  186.18,101.6 270 top
JP3  186.44,60.96 270 top
JP4  188.47,19.81 0 top
JP5  175.77,119.89 90 top
K1  KLT1C12DC12  [KLT_SERIES@1]  159.77,110.24 270 top
K2  KLT1C12DC12  [KLT_SERIES@1]  140.72,110.24 270 top
K3  KLT1C12DC12  [KLT_SERIES@1]  121.67,110.24 270 top
K4  KLT1C12DC12  [KLT_SERIES@1]  102.62,110.24 270 top
K5  KLT1C12DC12  [KLT_SERIES@1]  83.57,110.24 270 top
K6  KLT1C12DC12  [KLT_SERIES@1]  64.52,110.24 270 top
K7  KLT1C12DC12  [KLT_SERIES@1]  45.47,110.24 270 top
K8  KLT1C12DC12  [KLT_SERIES@1]  26.42,110.24 270 top
K9  KLT1C12DC12  [KLT_SERIES@1]  159.77,69.6 270 top
K10  KLT1C12DC12  [KLT_SERIES@1]  140.72,69.6 270 top
K11  KLT1C12DC12  [KLT_SERIES@1]  121.67,69.6 270 top
K12  KLT1C12DC12  [KLT_SERIES@1]  102.62,69.6 270 top
K13  KLT1C12DC12  [KLT_SERIES@1]  83.57,69.6 270 top
K14  KLT1C12DC12  [KLT_SERIES@1]  64.52,69.6 270 top
K15  KLT1C12DC12  [KLT_SERIES@1]  45.47,69.6 270 top
K16  KLT1C12DC12  [KLT_SERIES@1]  26.42,69.6 270 top
K17  KLT1C12DC12  [KLT_SERIES@1]  159.77,28.96 270 top
K18  KLT1C12DC12  [KLT_SERIES@1]  140.72,28.96 270 top
K19  KLT1C12DC12  [KLT_SERIES@1]  121.67,28.96 270 top
K20  KLT1C12DC12  [KLT_SERIES@1]  102.62,28.96 270 top
K21  KLT1C12DC12  [KLT_SERIES@1]  83.57,28.96 270 top
K22  KLT1C12DC12  [KLT_SERIES@1]  64.52,28.96 270 top
K23  KLT1C12DC12  [KLT_SERIES@1]  45.47,28.96 270 top
K24  KLT1C12DC12  [KLT_SERIES@1]  26.42,28.96 270 top
LED1  158.75,116.84 0 top
LED2  139.19,116.84 0 top
LED3  120.65,116.84 0 top
LED4  101.35,116.84 0 top
LED5  82.3,116.84 0 top
LED6  63.5,116.84 0 top
LED7  44.7,116.84 0 top
LED8  25.4,116.84 0 top
LED9  158.6,75.69 0 top
LED10  139.39,75.69 0 top
LED11  120.44,75.95 0 top
LED12  101.48,75.95 0 top
LED13  82.28,75.95 0 top
LED14  63.58,75.95 0 top
LED15  44.37,75.95 0 top
LED16  25.41,75.95 0 top
LED17  158.34,35.31 0 top
LED18  139.39,35.05 0 top
LED19  120.18,35.31 0 top
LED20  101.48,35.05 0 top
LED21  82.53,35.05 0 top
LED22  63.32,35.05 0 top
LED23  44.11,35.05 0 top
LED24  25.41,35.05 0 top
LED25  185.42,132.08 270 top
LED26  187.32,132.08 270 top
R1  162.56,116.84 180 top
R2  139.19,118.62 180 top
R3  120.65,118.62 180 top
R4  101.35,118.62 180 top
R5  82.3,118.62 180 top
R6  63.5,118.62 180 top
R7  44.7,118.62 180 top
R8  25.65,118.62 180 top
R9  159.77,89.92 180 bottom
R10  140.72,89.92 180 bottom
R11  121.67,89.92 180 bottom
R12  102.62,89.92 180 bottom
R13  83.57,89.92 180 bottom
R14  64.52,89.92 180 bottom
R15  45.47,89.92 180 bottom
R16  26.42,89.92 180 bottom
R17  183.13,104.65 180 top
R18  186.31,104.65 180 top
R19  158.75,77.22 180 top
R20  139.45,77.22 180 top
R21  120.4,77.47 180 top
R22  101.6,77.47 180 top
R23  82.3,77.47 180 top
R24  63.5,77.47 180 top
R25  44.45,77.47 180 top
R26  25.4,77.47 180 top
R27  185.42,64.01 180 top
R28  185.42,65.53 0 top
R29  159.77,49.28 180 bottom
R30  140.72,49.28 180 bottom
R31  121.67,49.28 180 bottom
R32  102.62,49.28 180 bottom
R33  64.52,49.28 180 bottom
R34  45.47,49.28 180 bottom
R35  26.42,49.28 180 bottom
R36  83.57,49.28 180 bottom
R37  158.5,36.83 180 top
R38  139.45,36.58 180 top
R39  120.14,36.83 180 top
R40  101.35,36.58 180 top
R41  82.55,36.58 180 top
R42  63.5,36.58 180 top
R43  44.2,36.58 180 top
R44  25.4,36.58 180 top
R45  185.67,22.86 180 top
R46  185.67,24.38 0 top
R47  159.77,8.64 180 bottom
R48  140.72,8.64 180 bottom
R49  121.67,8.64 180 bottom
R50  102.62,8.64 180 bottom
R51  64.52,8.64 180 bottom
R52  45.47,8.64 180 bottom
R53  26.42,8.64 180 bottom
R54  83.57,8.64 180 bottom
R55  181.61,132.08 90 top
R56  191.13,132.08 90 top
U1  180.34,96.52 90 top
U2  180.34,55.88 90 top
U3  180.34,15.24 90 top
U$3  [HV_SYMBOL]  7.62,135.64 0 top
U$5  [HV_SYMBOL]  99.06,66.04 0 top
U$6  [HV_SYMBOL]  142.24,135.25 0 top
U$8  [HV_SYMBOL]  58.42,7.37 0 top
U$9  CURRENT-LOGO-0.25"  [CURRENT-0.25"]  25.35,130.89 0 top
U$10  [HV_SYMBOL]  7.62,135.64 0 bottom
U$11  [HV_SYMBOL]  123.19,6.48 0 top
U$12  [HV_SYMBOL]  142.24,135.25 0 bottom
U$13  [HV_SYMBOL]  123.19,6.48 0 bottom
U$14  [HV_SYMBOL]  58.42,7.37 0 bottom
U$15  [HV_SYMBOL]  99.06,66.04 0 bottom
U$16  CURRENT-LOGO-0.25"  [CURRENT-0.25"]  124.51,130.89 0 bottom
U$17  [HV_SYMBOL]  182.88,73.03 0 bottom
U$18  [HV_SYMBOL]  182.88,73.03 0 top
X3  188.72,117.09 90 top
X8  2.54,28.96 270 top
X9  2.54,69.6 270 top
X10  2.54,110.24 270 top

### Tracks (layer width: path | path; a pad name or v marks a point on that pad's centre or on a via)
12V  (via drill 0.61, 0.9)
  Top 0.254: 183.3,94.19 arc-90 183.35,94.23 | R45.2 182.12,22.86 v181.86,23.11 | R27.2 182.12,64.01 v181.86,64.26 | LED26.A 187.45,131.06 187.45,129.29 184.4,129.29 179.58,124.46 179.58,111 180.85,109.73 181.36,109.73 X3.P$12 | R17.2 181.61,105.32 v181.61,106.05
  Top 0.508: 183.3,12.91 arc90 U3.1 181.93,12.95 181.93,11.58 arc-90 C8.1 | U2.1 arc-90 183.3,53.55 C5.1 183.81,50.65 C4.1 arc90 182.95,50.8 v181.86,50.8 | v181.86,90.68 182.95,90.68 arc90 C1.1 183.64,91.44 183.64,92.96 C2.1 183.3,94.19 arc90 U1.1
  Top 1.27: C8.1 181.93,11.43 C7.1 181.86,9.58 v181.86,7.37
  Bottom 0.254: 181.61,109.47 181.86,110.49
  Bottom 2.159: 181.86,6.86 v181.86,7.37 181.86,7.87 v181.86,23.11 v181.86,50.8 v181.86,64.26 v181.86,90.68 181.61,91.69 v181.61,106.05 181.61,109.47 X3.P$12
12V_RELAYDRIVE  (via drill 0.61)
  Top 0.254: LED25.A 184.88,131.03 v183.13,129.29
  Bottom 0.254: v183.13,129.29 182.88,129.29
  pour Bottom: -2.54,142.24 195.58,142.24 195.58,-2.54 -2.54,-2.54
  pour Top (rank 2): -2.54,142.24 177.8,142.24 177.8,-2.54 -2.54,-2.54
CASCADEDINPUT
  Bottom 0.254: X3.P$9 181.36,118.62 177.55,122.43 JP5.3
CLK  (via drill 0.61)
  Top 0.254: v185.93,96.27 184.91,95.25 184.4,95.25 184.15,95.5 183.39,95.5 U1.3 | v185.93,55.63 184.91,54.61 184.4,54.61 184.15,54.86 183.39,54.86 U2.3 | v184.91,12.7 184.4,13.21 184.4,13.97 184.15,14.22 183.39,14.22 U3.3
  Bottom 0.254: 184.4,112.52 X3.P$5 184.4,112.78 186.18,111 186.18,109.73 183.64,107.19 183.64,98.55 v185.93,96.27 184.91,95.25 184.4,95.25 183.9,94.74 183.9,57.15 184.4,56.64 184.91,56.64 v185.93,55.63 183.9,53.59 183.9,17.53 | 183.9,17.53 183.9,17.02 | v184.91,12.7 186.44,12.7 186.44,15.75 184.66,17.53 183.9,17.53
CS  (via drill 0.61)
  Top 0.254: v184.66,96.27 183.39,96.27 U1.4 | v184.66,55.63 183.39,55.63 U2.4 | v185.42,13.97 184.66,14.48 184.4,14.73 184.15,14.73 183.9,14.99 183.39,14.99 U3.4
  Bottom 0.254: X3.P$6 184.15,109.47 183.9,109.22 183.13,107.44 183.13,97.79 v184.66,96.27 183.39,95 183.39,56.9 | 183.39,56.9 v184.66,55.63 | 183.39,56.9 183.39,16.26 v185.42,13.97
DIN
  Bottom 0.254: X3.P$4 184.15,115.82 183.13,116.84 180.09,116.84 179.58,117.35 JP5.1
DIN_DRIVER1  (via drill 0.61)
  Top 0.254: U1.2 183.39,95 183.9,95 184.15,94.74 v185.67,94.74 | v188.85,96.01 188.85,105.03 185.93,107.95 181.36,107.95 179.58,109.73 179.58,110.24 179.07,110.74 179.07,117.6 176.78,119.89 JP5.2
  Bottom 0.254: v188.85,96.01 187.58,94.74 v185.67,94.74
DOUT_DRIVER1  (via drill 0.61)
  Top 0.254: v187.2,55.63 186.94,55.88 186.94,55.37 186.18,54.61 185.67,54.61 184.91,53.85 184.4,53.85 183.9,54.36 183.39,54.36 U2.2 | v184.91,81.53 180.85,85.6 180.85,94.74 182.37,96.27 182.37,97.28 182.63,97.54 183.13,97.54 U1.6
  Bottom 0.254: v187.2,55.63 184.4,58.42 184.4,81.03 v184.91,81.53
DOUT_DRIVER2
  Top 0.254: U3.2 183.13,13.72 182.63,13.72 182.37,13.97 182.37,20.83 180.59,22.61 180.59,54.1 182.37,55.88 182.37,56.64 182.63,56.9 183.13,56.9 U2.6
DOUT_DRIVER3  (via drill 0.61)
  Top 0.254: U3.6 183.39,16.26 185.42,16.26 185.67,16 189.23,16 191.77,18.54 191.77,112.52 v190.75,114.05
  Bottom 0.254: v190.75,114.05 187.96,116.84 187.96,117.6 185.42,120.14 185.17,120.14 184.91,120.4 183.9,120.4 183.64,120.14 183.39,120.14 183.13,120.4 182.63,120.4 181.61,121.41 X3.P$8 181.36,121.67 177.55,125.48 JP1.2
DOUT_FINAL
  Top 0.254: X3.P$7 181.36,124.46
  Bottom 0.254: JP1.1 178.05,128.02 181.36,124.71 X3.P$7
EN1
  Top 0.254: 185.42,104.65 R17.1 183.9,104.65 183.9,99.57 184.15,99.31 184.15,99.06 183.9,98.81 183.39,98.81 U1.8 | JP2.1 185.67,102.87 185.42,103.12 185.42,104.65 | 185.42,104.65 R18.2
EN2
  Top 0.254: 186.18,64.01 186.18,65.28 R28.2 | U2.8 183.39,58.17 184.66,58.17 184.66,58.42 184.4,58.67 184.4,60.2 JP3.1 186.18,62.48 186.18,64.01 | 186.18,64.01 R27.1
EN3
  Top 0.254: U3.8 183.39,17.53 184.91,17.53 JP4.1 186.44,20.57 186.44,21.59 186.52,21.59 | 186.52,21.59 186.52,21.5 | 186.52,21.59 R45.1 186.44,22.86 186.44,24.13 R46.2
FAULT1
  Top 0.254: JP2.2 186.18,98.81 185.42,98.04 183.39,98.04 U1.7
FAULT2
  Top 0.254: JP3.2 186.44,59.18 184.66,57.4 183.39,57.4 U2.7
FAULT3
  Top 0.254: U3.7 183.39,16.76 185.67,16.76 185.93,16.51 188.98,16.51 189.74,17.27 JP4.2
GND
  Top 0.254: 184.15,15.75 183.9,15.49 183.39,15.49 U3.5 | 185.94,57.94 185.93,57.91 184.91,56.9 184.66,56.9 183.9,56.13 183.39,56.13 U2.5 | 184.15,97.03 183.9,96.77 183.39,96.77 U1.5 | C5.2 185.42,52.41 185.42,53.09
  pour Top: 179.07,142.24 195.58,142.24 195.58,-2.54 179.07,-2.54
KDRIVE1
  Top 0.254: U1.16 177.55,94.23 179.58,94.23 181.86,96.52 181.86,102.62 177.55,106.93 163.07,106.93 K1.P$3 163.32,113.79 163.32,116.84 R1.1
KDRIVE2
  Top 0.254: R2.1 139.95,118.62 139.95,119.13 140.72,119.13 141.73,118.11 141.73,115.57 140.72,114.55 K2.P$3 144.53,106.43 177.29,106.43 181.36,102.36 181.36,96.77 179.58,95 177.55,95 U1.15
KDRIVE3
  Top 0.254: R3.1 121.41,118.62 121.41,119.13 122.17,119.13 123.19,118.11 123.19,115.57 121.67,114.05 K3.P$3 125.98,105.92 177.04,105.92 180.85,102.11 180.85,97.03 179.32,95.5 177.55,95.5 U1.14
KDRIVE4
  Top 0.254: R4.1 102.11,118.62 102.11,119.13 102.87,119.13 103.89,118.11 103.89,115.57 102.62,114.3 K4.P$3 107.44,105.41 176.78,105.41 180.34,101.85 180.34,97.28 179.32,96.27 177.55,96.27 U1.13
KDRIVE5
  Top 0.254: R5.1 83.06,118.62 83.06,119.13 83.82,119.13 84.84,118.11 84.84,115.57 83.57,114.3 K5.P$3 88.9,104.9 176.53,104.9 179.83,101.6 179.83,97.54 179.07,96.77 177.55,96.77 U1.12
KDRIVE6
  Top 0.254: R6.1 64.26,118.62 64.26,119.13 65.02,119.13 66.04,118.11 66.04,115.57 64.52,114.05 K6.P$3 70.36,104.39 176.28,104.39 179.32,101.35 179.32,97.79 179.07,97.54 177.55,97.54 U1.11
KDRIVE7
  Top 0.254: R7.1 45.47,118.62 45.47,119.13 46.23,119.13 47.24,118.11 47.24,115.57 45.47,113.79 K7.P$3 47.24,108.46 51.05,108.46 55.63,103.89 176.02,103.89 176.1,103.78 178.76,101.12 178.76,100 178.69,99.9 178.69,98.63 178.18,98.12 177.44,98.12 U1.10
KDRIVE8
  Top 0.254: R8.1 26.42,118.62 26.42,119.13 26.92,119.13 27.94,118.11 27.94,115.57 26.42,114.05 K8.P$3 28.7,107.95 50.8,107.95 55.37,103.38 175.77,103.38 178.05,101.09 178.05,98.81 177.55,98.81 U1.9
KDRIVE9
  Top 0.254: R19.1 160.53,77.22 162.05,75.69 162.05,71.88 K9.P$3 162.05,67.31 177.55,67.31 181.86,62.99 181.86,56.13 179.32,53.59 177.55,53.59 U2.16
KDRIVE10
  Top 0.254: R20.1 141.48,77.22 142.24,76.45 142.24,71.63 140.46,69.85 K10.P$3 143.51,66.8 177.29,66.8 181.36,62.74 181.36,56.39 179.32,54.36 177.55,54.36 U2.15
KDRIVE11
  Top 0.254: R21.1 122.17,77.47 122.94,76.71 122.94,70.87 K11.P$3 124.97,66.29 177.04,66.29 180.85,62.48 180.85,56.64 179.07,54.86 177.55,54.86 U2.14
KDRIVE12
  Top 0.254: R22.1 103.38,77.47 104.9,75.95 104.9,71.88 K12.P$3 106.43,65.79 176.78,65.79 180.34,62.23 180.34,56.9 179.07,55.63 177.55,55.63 U2.13
KDRIVE13
  Top 0.254: R23.1 84.07,77.47 84.84,76.71 84.84,70.87 K13.P$3 87.88,65.28 176.53,65.28 179.83,61.98 179.83,57.15 178.82,56.13 177.55,56.13 U2.12
KDRIVE14
  Top 0.254: R24.1 65.28,77.47 66.8,75.95 66.8,71.88 K14.P$3 69.34,64.77 176.28,64.77 179.32,61.72 179.32,57.4 178.82,56.9 177.55,56.9 U2.11
KDRIVE15
  Top 0.254: R25.1 46.23,77.47 47.75,75.95 47.75,71.88 K15.P$3 50.8,64.26 176.02,64.26 178.82,61.47 178.82,57.66 178.56,57.4 177.55,57.4 U2.10
KDRIVE16
  Top 0.254: R26.1 27.18,77.47 27.94,76.71 27.94,71.12 K16.P$3 32.26,63.75 175.77,63.75 178.31,61.21 178.31,58.42 178.05,58.17 177.55,58.17 U2.9
KDRIVE17
  Top 0.254: R37.1 160.27,36.83 161.8,35.31 161.8,31.5 159.51,29.21 K17.P$3 161.54,27.18 175.26,27.18 181.86,20.57 181.86,15.49 179.32,12.95 177.55,12.95 U3.16
KDRIVE18
  Top 0.254: R38.1 141.48,36.58 142.24,35.81 142.24,30.99 140.46,29.21 K18.P$3 143,26.67 175.01,26.67 181.36,20.32 181.36,15.75 179.32,13.72 177.55,13.72 U3.15
KDRIVE19
  Top 0.254: R39.1 121.92,36.83 122.68,36.07 122.68,30.48 121.41,29.21 K19.P$3 124.46,26.16 174.75,26.16 180.85,20.07 180.85,16 179.07,14.22 177.55,14.22 U3.14
KDRIVE20
  Top 0.254: R40.1 103.12,36.58 104.65,35.05 104.65,30.99 K20.P$3 105.92,25.65 174.5,25.65 180.34,19.81 180.34,16.26 179.07,14.99 177.55,14.99 U3.13
KDRIVE21
  Top 0.254: R41.1 84.33,36.58 85.09,35.81 85.09,30.48 K21.P$3 87.38,25.15 174.24,25.15 179.83,19.56 179.83,16.51 178.82,15.49 177.55,15.49 U3.12
KDRIVE22
  Top 0.254: R42.1 64.26,36.58 64.26,36.83 64.52,36.83 66.29,35.05 66.29,30.73 K22.P$3 68.83,24.64 173.99,24.64 179.32,19.3 179.32,16.76 178.82,16.26 177.55,16.26 U3.11
KDRIVE23
  Top 0.254: R43.1 45.97,36.58 47.5,35.05 47.5,31.5 45.21,29.21 K23.P$3 50.29,24.13 173.74,24.13 178.82,19.05 178.82,17.02 178.56,16.76 177.55,16.76 U3.10
KDRIVE24
  Top 0.254: R44.1 27.43,36.58 27.94,36.07 27.94,30.48 K24.P$3 31.75,23.62 173.48,23.62 178.31,18.8 178.31,17.78 178.05,17.53 177.55,17.53 U3.9
N$1
  Top 0.254: R1.2 161.54,116.84 159.77,118.62 158.5,118.62 157.73,117.86 157.73,116.84 LED1.C
N$2
  Top 0.254: R2.2 138.43,118.62 138.43,116.84 LED2.C
N$3
  Top 0.254: LED3.C 119.63,116.84 119.89,117.09 119.89,118.62 R3.2
N$4
  Top 0.254: LED4.C 100.33,116.84 100.58,117.09 100.58,118.62 R4.2
N$5
  Top 0.254: LED5.C 81.28,116.84 81.53,117.09 81.53,118.62 R5.2
N$6
  Top 0.254: LED6.C 62.48,116.84 62.74,117.09 62.74,118.62 R6.2
N$7
  Top 0.254: LED7.C 43.69,116.84 43.94,117.09 43.94,118.62 R7.2
N$8
  Top 0.254: LED8.C 24.89,116.84 24.89,118.62 R8.2
N$9
  Top 2.159: R10.P$1 K2.P$4
N$10
  Top 2.159: R11.P$1 K3.P$4
N$11
  Top 2.159: R12.P$1 K4.P$4
N$12
  Top 2.159: R13.P$1 K5.P$4
N$13
  Top 2.159: R14.P$1 K6.P$4
N$14
  Top 2.159: R15.P$1 K7.P$4
N$15
  Top 2.159: K1.P$4 R9.P$1
N$16
  Top 2.159: R16.P$1 K8.P$4
N$17
  Top 0.254: LED9.C 157.99,75.69 157.99,77.22 R19.2
N$18
  Top 0.254: LED10.C 138.68,75.69 138.68,77.22 R20.2
N$19
  Top 0.254: LED11.C 119.63,75.95 119.63,77.47 R21.2
N$20
  Top 0.254: LED12.C 100.84,75.95 100.84,77.47 R22.2
N$21
  Top 0.254: LED13.C 81.53,75.95 81.53,77.47 R23.2
N$22
  Top 0.254: LED14.C 62.74,75.95 62.74,77.47 R24.2
N$23
  Top 0.254: LED15.C 43.69,75.95 43.69,77.47 R25.2
N$24
  Top 0.254: LED16.C 24.36,77.28 R26.2
N$25
  Top 2.159: R29.P$1 K9.P$4
N$26
  Top 2.159: R30.P$1 K10.P$4
N$27
  Top 2.159: R31.P$1 121.92,49.53 121.92,56.9 121.67,57.15 K11.P$4
N$28
  Top 2.159: R32.P$1 K12.P$4
N$29
  Top 2.159: R36.P$1 K13.P$4
N$30
  Top 2.159: R33.P$1 K14.P$4
N$31
  Top 2.159: R34.P$1 K15.P$4
N$32
  Top 2.159: R35.P$1 K16.P$4
N$33
  Top 0.254: LED17.C 157.48,35.31 157.73,35.56 157.73,36.83 R37.2
N$34
  Top 0.254: LED18.C 138.43,35.05 138.68,35.31 138.68,36.58 R38.2
N$35
  Top 0.254: LED19.C 119.38,35.31 119.38,36.83 R39.2
N$36
  Top 0.254: LED20.C 100.58,35.05 100.58,36.58 R40.2
N$37
  Top 0.254: LED21.C 81.53,35.05 81.79,35.31 81.79,36.58 R41.2
N$38
  Top 0.254: LED22.C 62.48,35.05 62.74,35.31 62.74,36.58 R42.2
N$39
  Top 0.254: LED23.C 43.18,35.05 43.43,35.31 43.43,36.58 R43.2
N$40
  Top 0.254: LED24.C 24.38,35.05 24.64,35.31 24.64,36.58 R44.2
N$41
  Top 2.159: R47.P$1 K17.P$4
N$42
  Top 2.159: R48.P$1 K18.P$4
N$43
  Top 2.159: R49.P$1 K19.P$4
N$44
  Top 2.159: R50.P$1 K20.P$4
N$45
  Top 2.159: R54.P$1 K21.P$4
N$46
  Top 2.159: R51.P$1 K22.P$4
N$47
  Top 2.159: R52.P$1 K23.P$4
N$48
  Top 2.159: R53.P$1 K24.P$4
N$49
  Top 0.254: R55.2 181.61,132.84 183.64,132.84 183.9,133.1 185.42,133.1 LED25.C
N$50
  Top 0.254: R56.2 191.01,132.84 188.98,132.84 188.72,133.1 187.45,133.1 LED26.C
VC1+
  Bottom 2.159: X8.7 11.18,22.1 20.32,31.24 32.26,31.24 K24.P$2 33.02,30.48 41.4,22.1 41.4,17.53 44.45,14.48 44.7,14.48 R52.P$2
VC1-
  Bottom 2.159: R53.P$2 29.72,8.64 20.07,18.29 9.65,18.29 X8.8
VC2+
  Bottom 2.159: X8.6 11.18,25.65 19.3,33.78 33.27,33.78 35.81,31.24 51.31,31.24 K23.P$2 52.07,30.48 60.45,22.1 60.45,17.53 63.5,14.48 63.75,14.48 R51.P$2
VC3+
  Bottom 2.159: X8.5 10.92,28.96 18.29,36.32 34.29,36.32 36.83,33.78 52.32,33.78 54.86,31.24 70.36,31.24 K22.P$2 71.12,30.48 79.5,22.1 79.5,17.53 82.55,14.48 82.8,14.48 R54.P$2
VC4+
  Bottom 2.159: X8.4 10.92,32.51 17.27,38.86 35.31,38.86 37.85,36.32 53.34,36.32 55.88,33.78 71.37,33.78 73.91,31.24 89.41,31.24 K21.P$2 90.17,30.48 98.55,22.1 98.55,17.53 101.6,14.48 101.85,14.48 R50.P$2
VC5+
  Bottom 2.159: X8.3 10.92,36.07 16.26,41.4 36.32,41.4 38.86,38.86 54.36,38.86 56.9,36.32 72.39,36.32 74.93,33.78 90.42,33.78 92.96,31.24 108.46,31.24 K20.P$2 109.22,30.23 117.6,21.84 117.6,17.53 120.65,14.48 120.9,14.48 R49.P$2
VC6+
  Top 2.159: X8.2 123.1,39.46 127.67,34.89 K19.P$2
  Bottom 2.159: R48.P$2 139.95,14.48 139.7,14.48 136.65,17.53 136.65,22.1 127.76,30.99 K19.P$2
VC7+
  Top 2.159: X8.1 141.19,42.96 146.72,37.43 K18.P$2
  Bottom 2.159: R47.P$2 159,14.48 158.75,14.48 155.7,17.53 155.7,22.1 146.81,30.99 K18.P$2
VC8+
  Top 2.159: K17.P$2 165.61,31.24 163.32,33.53 163.32,36.07 160.02,39.37 148.34,39.37 142.24,45.47 35.31,45.47 R35.P$2
  Bottom 2.159: R35.P$2 29.72,49.28 23.62,55.37 9.54,55.37 X9.9
VC9+
  Bottom 2.159: X9.8 11.18,59.18 23.88,71.88 32.26,71.88 K16.P$2 33.02,71.12 41.4,62.74 41.4,58.17 48.51,51.05 48.51,50.8 50.04,49.28 R34.P$2
VC10+
  Bottom 2.159: X9.7 11.18,62.74 22.86,74.42 33.27,74.42 35.81,71.88 51.31,71.88 K15.P$2 52.07,71.12 60.45,62.74 60.45,58.17 63.5,55.12 63.75,55.12 R33.P$2
VC11+
  Bottom 2.159: X9.6 11.18,66.29 21.84,76.96 34.29,76.96 36.83,74.42 52.32,74.42 54.86,71.88 70.36,71.88 K14.P$2 71.12,71.12 79.5,62.74 79.5,57.66 84.07,53.09 85.09,52.83 R36.P$2
VC12+
  Bottom 2.159: R32.P$2 105.92,51.05 105.16,51.56 98.55,58.17 98.55,62.74 90.17,71.12 K13.P$2 89.41,71.88 73.91,71.88 71.37,74.42 55.88,74.42 53.34,76.96 37.85,76.96 35.31,79.5 20.83,79.5 10.92,69.6 X9.5
VC13+
  Bottom 2.159: X9.4 10.92,73.15 19.81,82.04 36.32,82.04 38.86,79.5 54.36,79.5 56.9,76.96 72.39,76.96 74.93,74.42 90.42,74.42 92.96,71.88 108.46,71.88 K12.P$2 109.22,71.12 117.6,62.74 117.6,57.91 126.24,49.28 R31.P$2
VC14+
  Bottom 2.159: X9.3 10.92,76.71 18.8,84.58 37.34,84.58 39.88,82.04 55.37,82.04 57.91,79.5 73.41,79.5 75.95,76.96 91.44,76.96 93.98,74.42 109.47,74.42 112.01,71.88 127.51,71.88 K11.P$2 128.27,70.87 136.65,62.48 136.65,57.91 141.73,52.83 142.49,52.58 R30.P$2
VC15+
  Top 2.159: X9.2 142.92,80.1 146.72,76.3 K10.P$2
  Bottom 2.159: K10.P$2 146.81,71.63 155.7,62.74 155.7,57.91 160.53,53.09 161.29,52.83 R29.P$2
VC16+
  Top 2.159: X9.1 31.5,83.6 | 31.5,83.6 159.23,83.6 165.77,77.06 K9.P$2 | 31.5,83.6 R16.P$2
VC17+
  Bottom 2.159: X10.8 9.65,99.82 10.41,99.82 23.11,112.52 32.26,112.52 K8.P$2 33.02,111.51 41.4,103.12 41.4,98.81 44.45,95.76 44.7,95.76 R15.P$2
VC18+
  Bottom 2.159: X10.7 9.65,103.38 10.41,103.38 23.88,116.84 23.88,117.35 24.89,118.36 45.47,118.36 51.31,112.52 K7.P$2 52.07,111.51 60.45,103.12 60.45,98.81 63.5,95.76 63.75,95.76 R14.P$2
VC19+
  Bottom 2.159: X10.6 9.65,106.93 10.41,106.93 21.59,118.11 21.59,118.62 23.88,120.9 61.98,120.9 70.36,112.52 K6.P$2 71.12,111.51 79.5,103.12 79.5,98.81 82.55,95.76 82.8,95.76 R13.P$2
VC20+
  Bottom 2.159: X10.5 10.16,110.24 19.3,119.38 19.3,119.89 22.86,123.44 78.49,123.44 89.41,112.52 K5.P$2 90.17,111.76 98.55,103.38 98.55,98.81 103.12,94.23 103.89,93.73 R12.P$2
VC21+
  Bottom 2.159: X10.4 9.65,113.54 9.91,113.54 17.02,120.65 17.02,121.16 21.84,125.98 79.5,125.98 92.96,112.52 108.46,112.52 K4.P$2 109.22,111.76 117.6,103.38 117.6,98.3 122.68,93.22 123.7,92.96 R11.P$2
VC22+
  Bottom 2.159: X10.3 9.65,117.09 9.91,117.09 14.73,121.92 14.73,122.43 20.83,128.52 80.52,128.52 93.98,115.06 109.47,115.06 112.01,112.52 127.51,112.52 K3.P$2 128.27,111.51 136.65,103.12 136.65,98.55 141.99,93.22 142.75,92.96 R10.P$2
VC23+
  Top 2.159: X10.2 143.17,120.74 146.72,117.19 K2.P$2
  Bottom 2.159: K2.P$2 146.81,112.27 155.7,103.38 155.7,98.81 160.78,93.73 161.54,93.22 R9.P$2
VC24+
  Top 2.159: X10.1 159.99,124.24 165.77,118.46 K1.P$2

### Text on the board
tPlace: Danger: High Voltage! | OK | Balancer Relay Board | RELAY | 12V | OK | V1.0 | Serial Data Output | Short these pins | Danger: High Voltage! | on final board ---> | in cascade ------> | <-VC24+ | Battery Highside | Cascaded Board----> | Serial Data Input | First Board---> | . . . | Zip Tie! | <-VC17+ | <- | DNP this connector | Integrated | <-Not connected | Solder wires directly to board | Fault Protection | Cell 17 Relay | Cell 24 Relay | <-VC16+ | Zip Tie! | Zip Tie! | Zip Tie! | . . . | <-Integrated | Fault Protection | DNP this connector | <-VC8+ | Solder wires directly to board | Cell 9 Relay | Cell 16 Relay | <-VC7+ | Zip Tie! | Zip Tie! | Zip Tie! | . . . | <-Integrated | Fault Protection | <-VC1- | DNP this connector | <-Not connected | Solder wires directly to board | Battery Lowside | Cell 1 Relay | Cell 8 Relay | Zip Tie! | Zip Tie! | Danger: High Voltage! | Danger: High Voltage!
bPlace: Danger: High Voltage! | Balancer Relay Board | V1.0 | Danger: High Voltage! | VC24+ -> | Battery Highside | Com | Com | Coil- | Coil+ | Coil- | Coil+ | Cell 17 Relay | Cell 24 Relay | NO | NC | NO | NC | VC17+ -> | Not Connected-> | VC16+ -> | Com | Com | Coil- | Coil+ | Coil- | Coil+ | Cell 9 Relay | Cell 16 Relay | NO | NC | NO | NC | Danger: High Voltage! | VC8+ -> | Danger: High Voltage! | VC7+ -> | Com | Com | Coil- | Coil+ | Coil- | Coil+ | Cell 8 Relay | Cell 1 Relay | NO | NC | NO | NC | VC1+ -> | Not Connected-> | Battery Lowside | Danger: High Voltage! | Danger: High Voltage!